# EasyEDA Pro project 三轮车驱动板.epro

# Schematic Schematic1

## Sheets
1 Power: Create Date: 2023-05-07; Page Name: Power; Project Name: 光设2023; Schematic Name: Schematic1; Update Date: 2023-05-07; Add into BOM: yes; Convert to PCB: yes
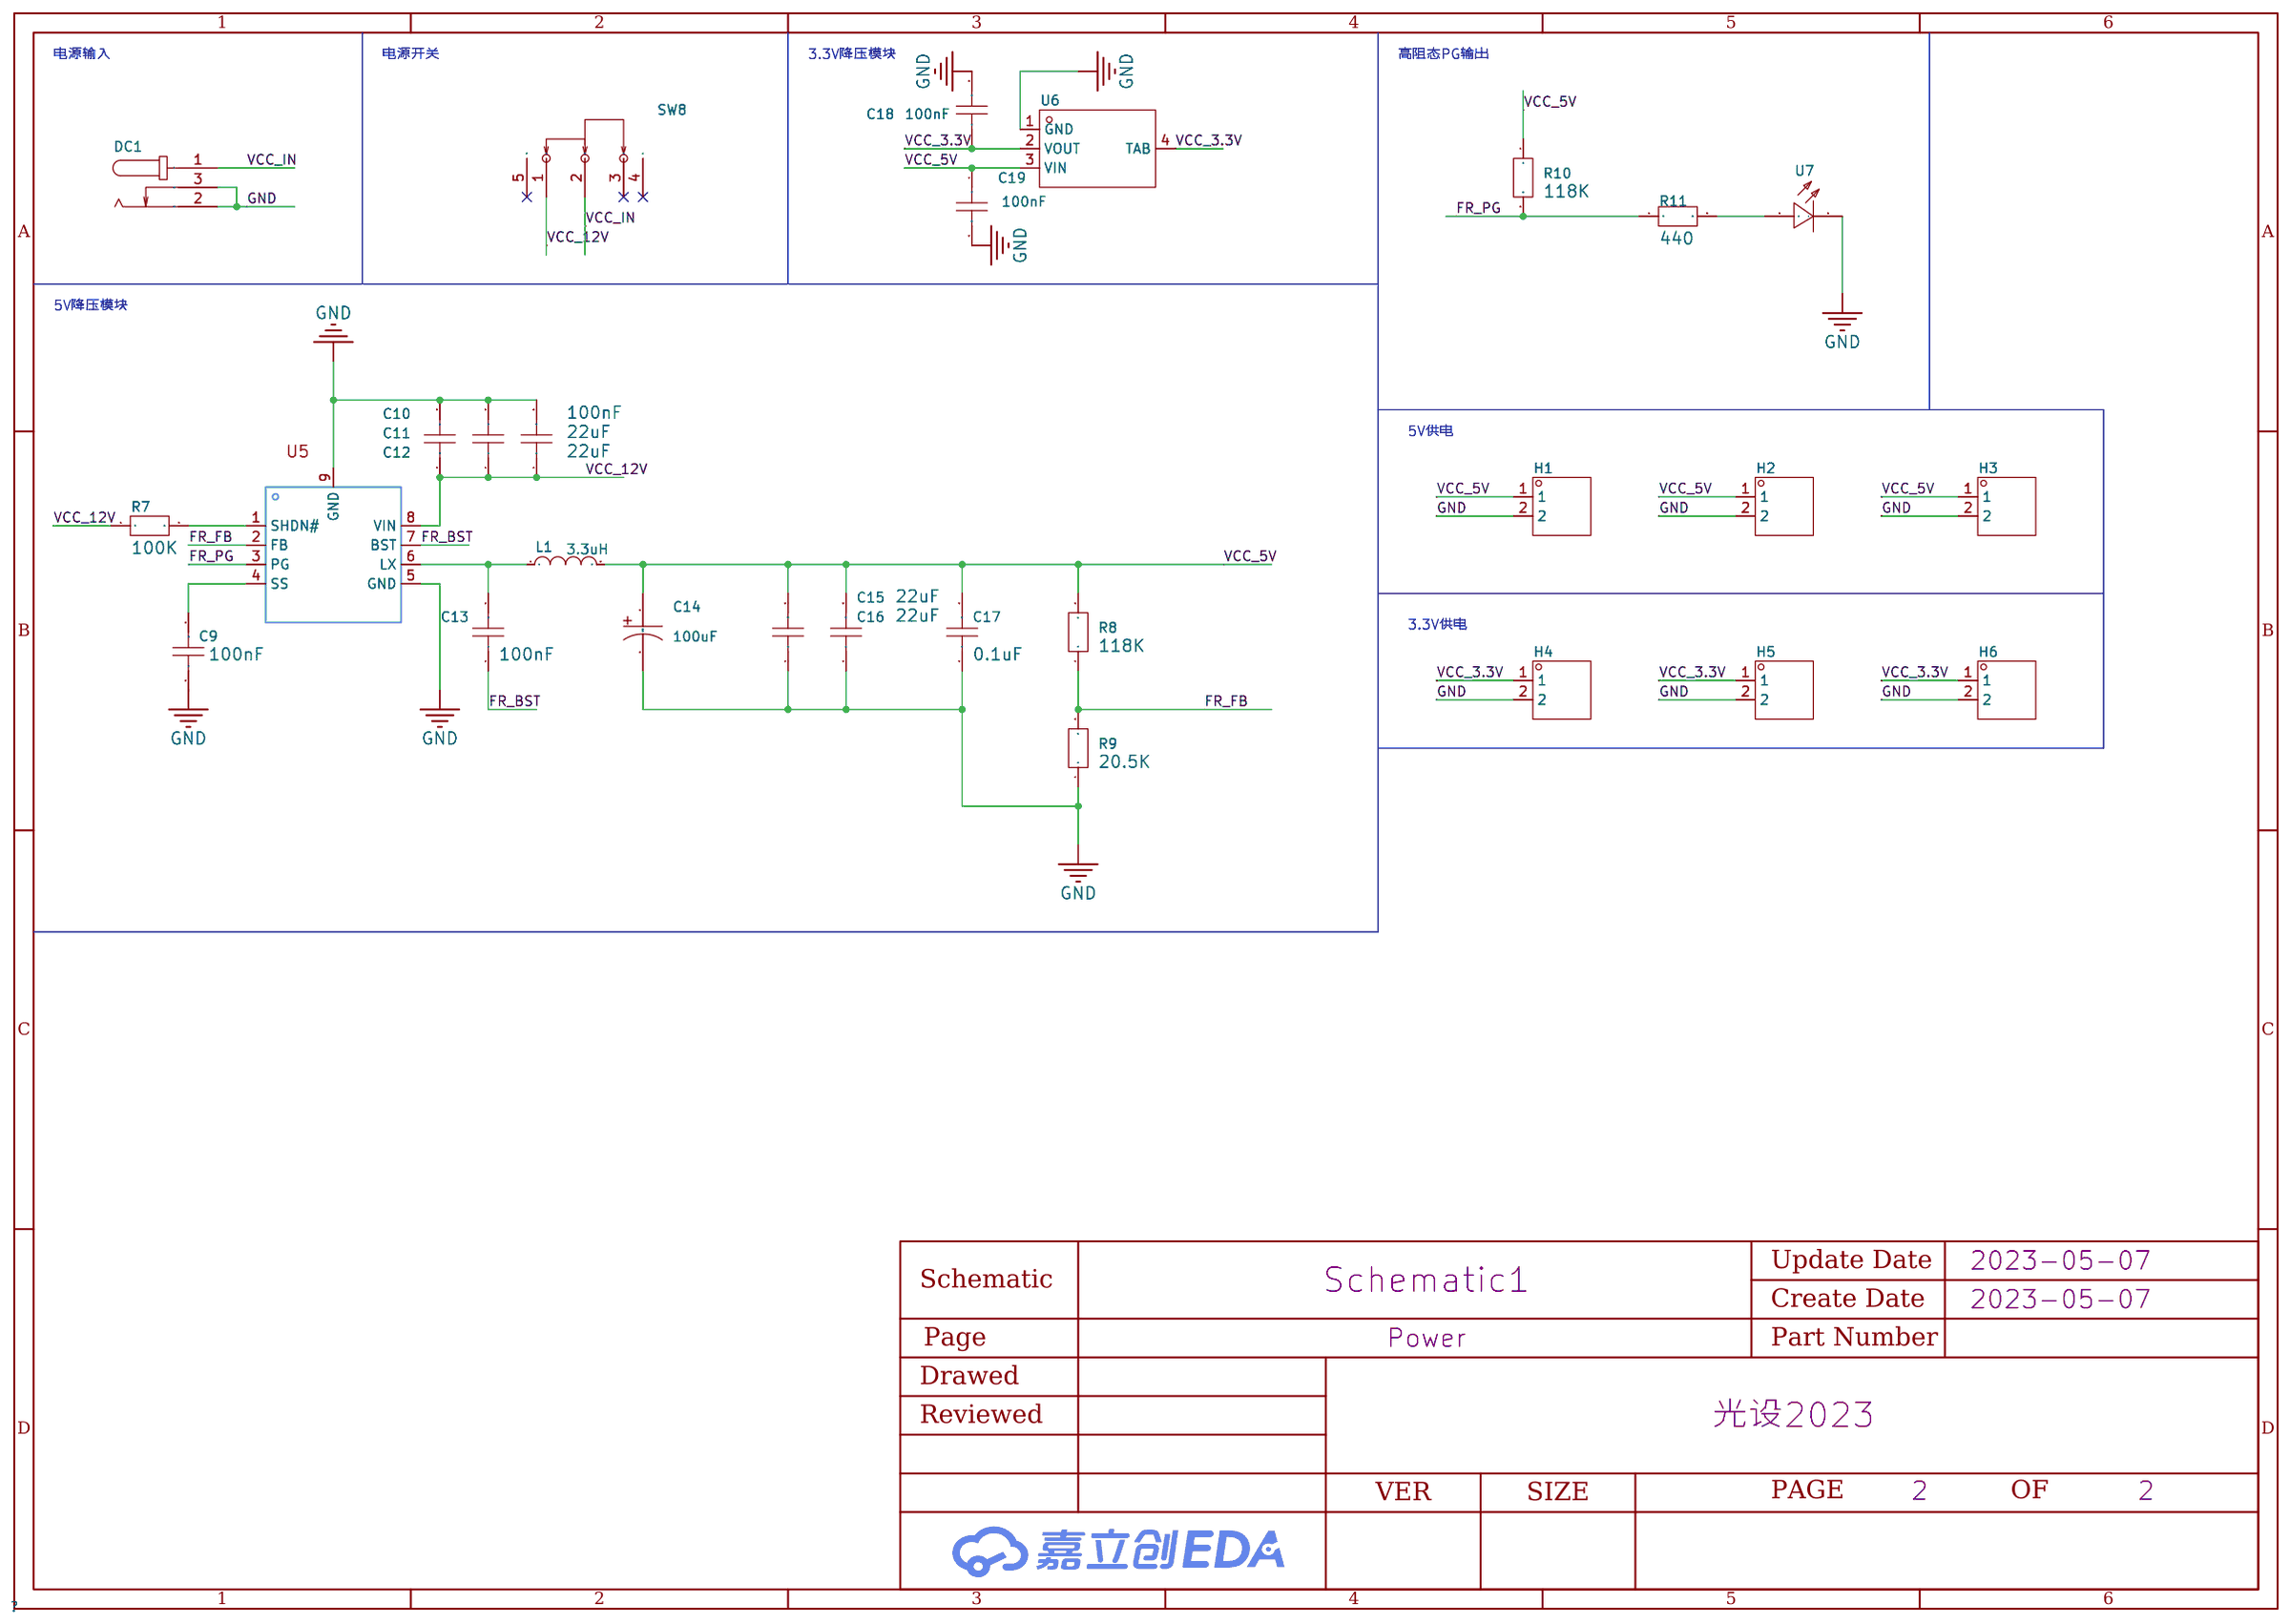
[diagram p0: Power]
2 C8T6: Create Date: 2023-05-08; Page Name: C8T6; Update Date: 2023-05-08; Company: 嘉立创EDA
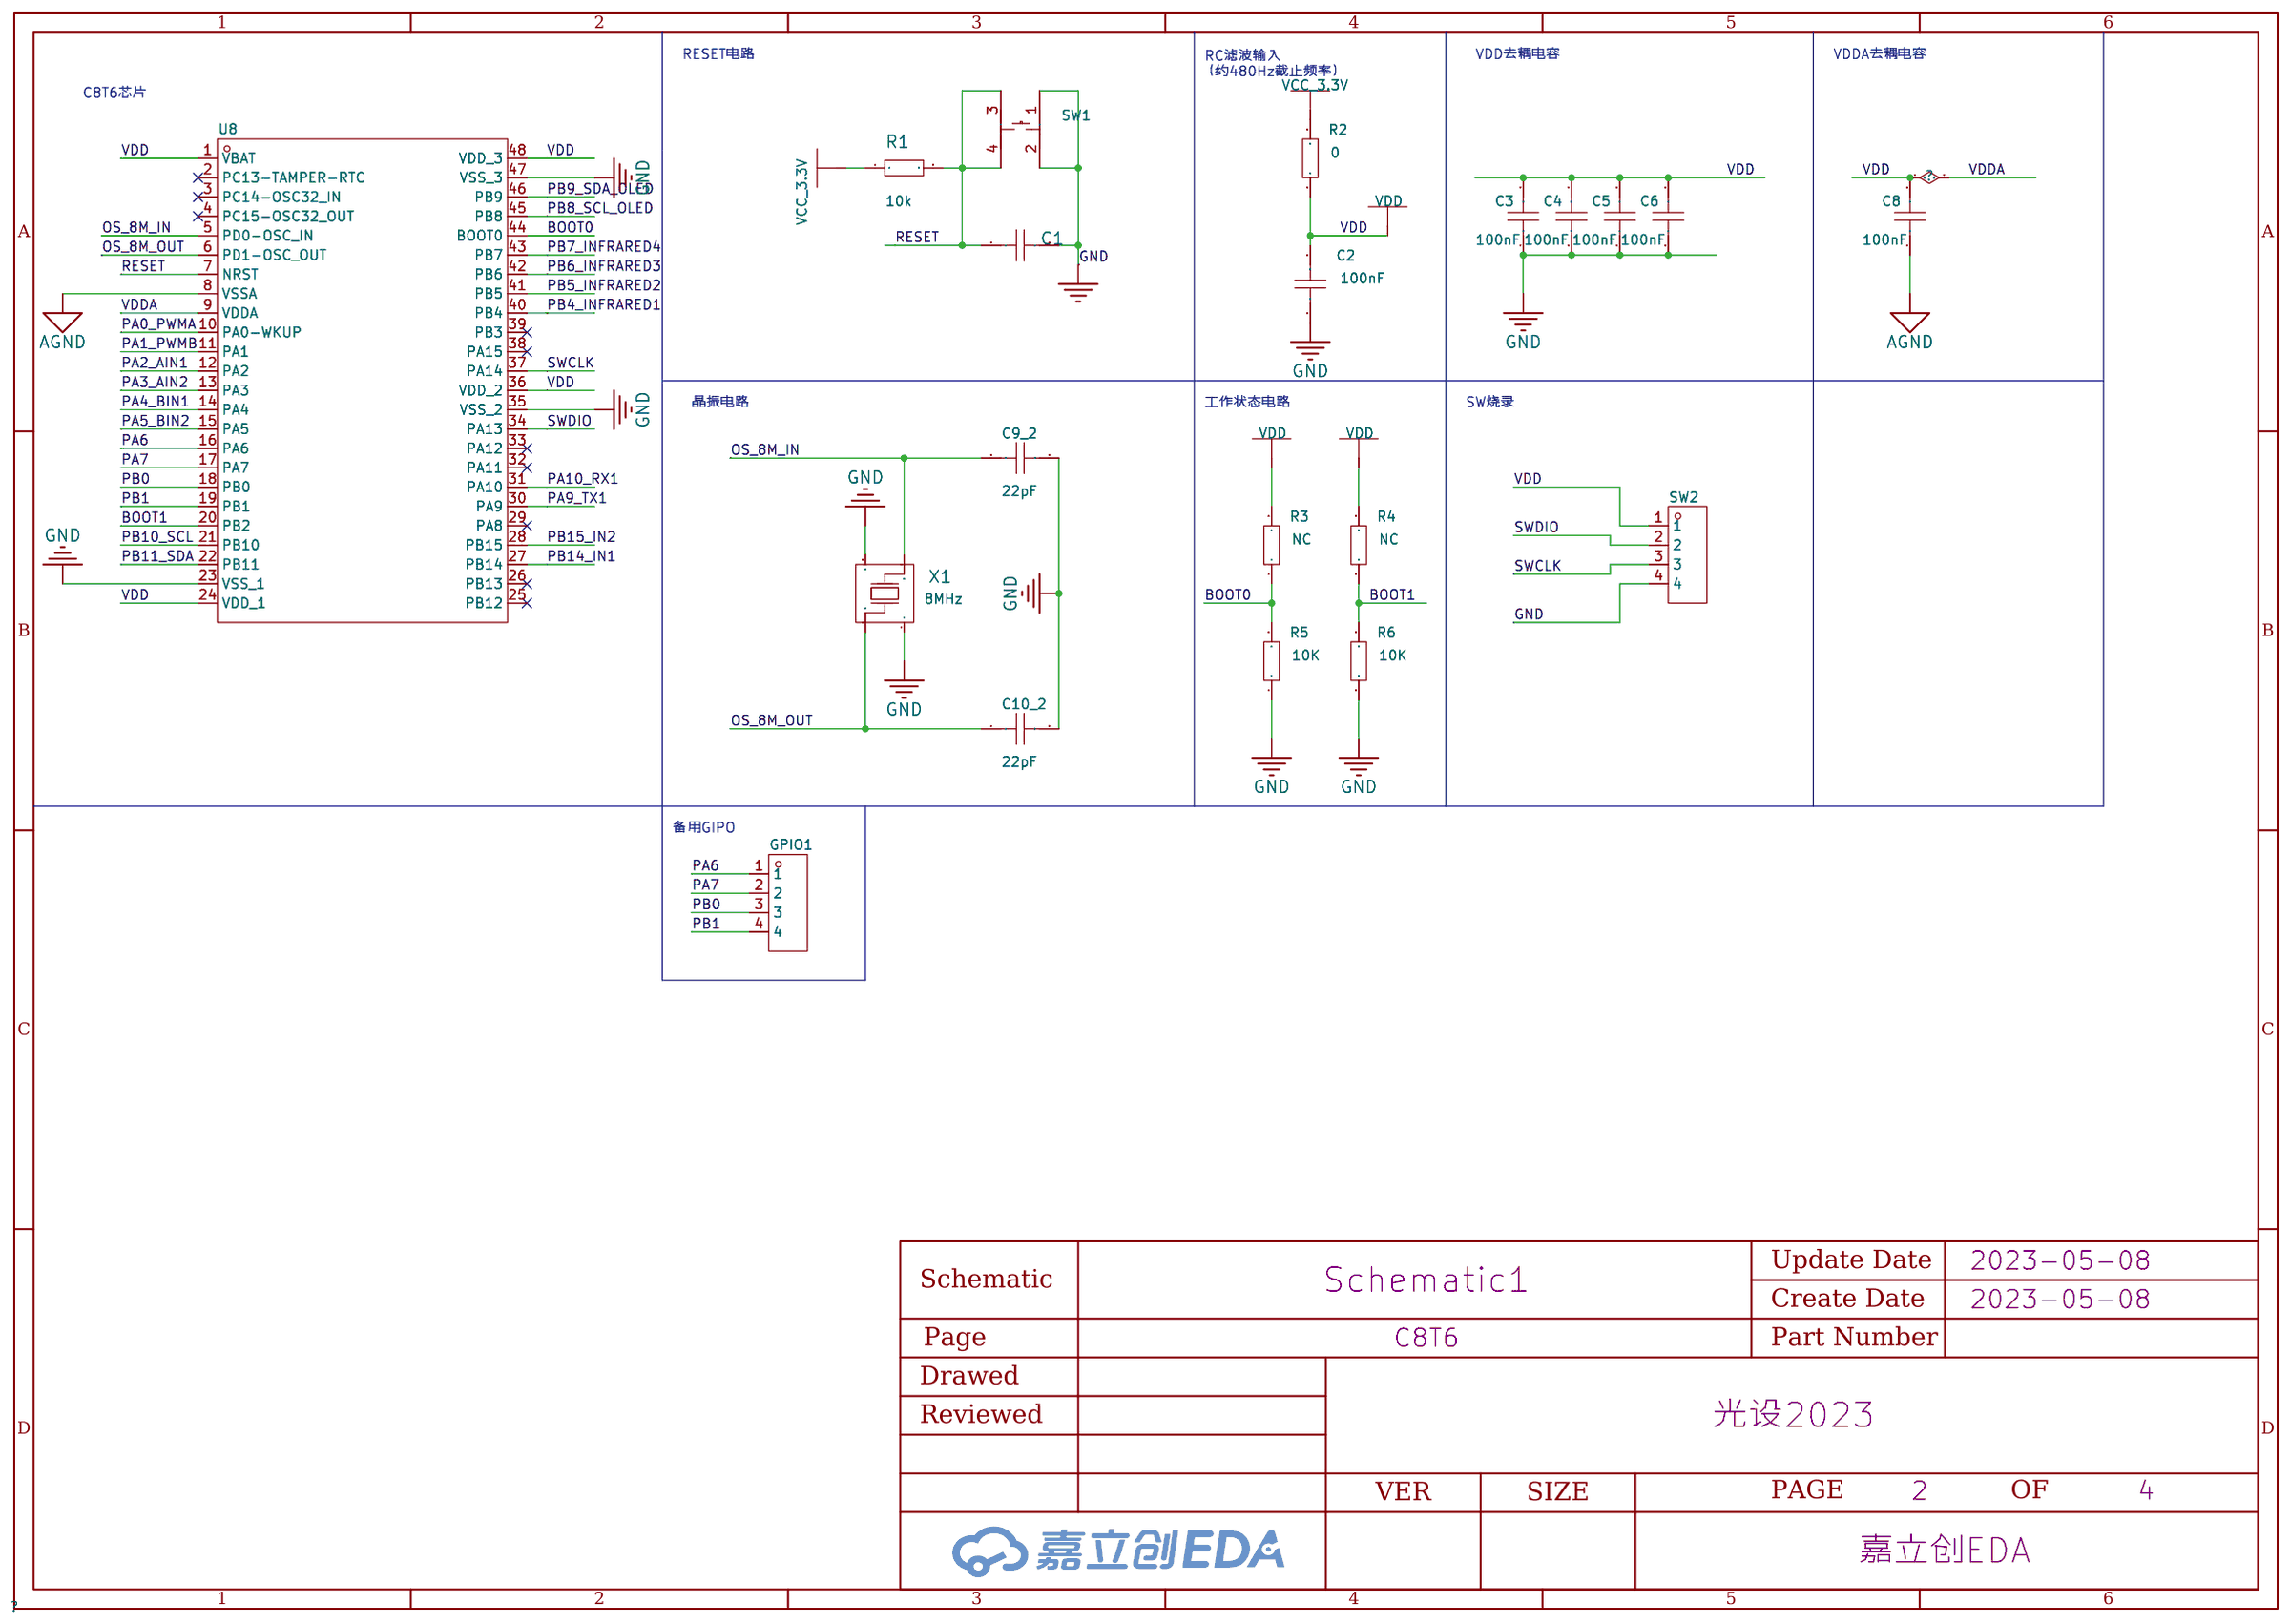
[diagram p1: C8T6]
3 raspberry: Create Date: 2023-05-08; Page Name: raspberry; Update Date: 2023-05-08; Company: 嘉立创EDA; Page Size: A4; Version: V1.0
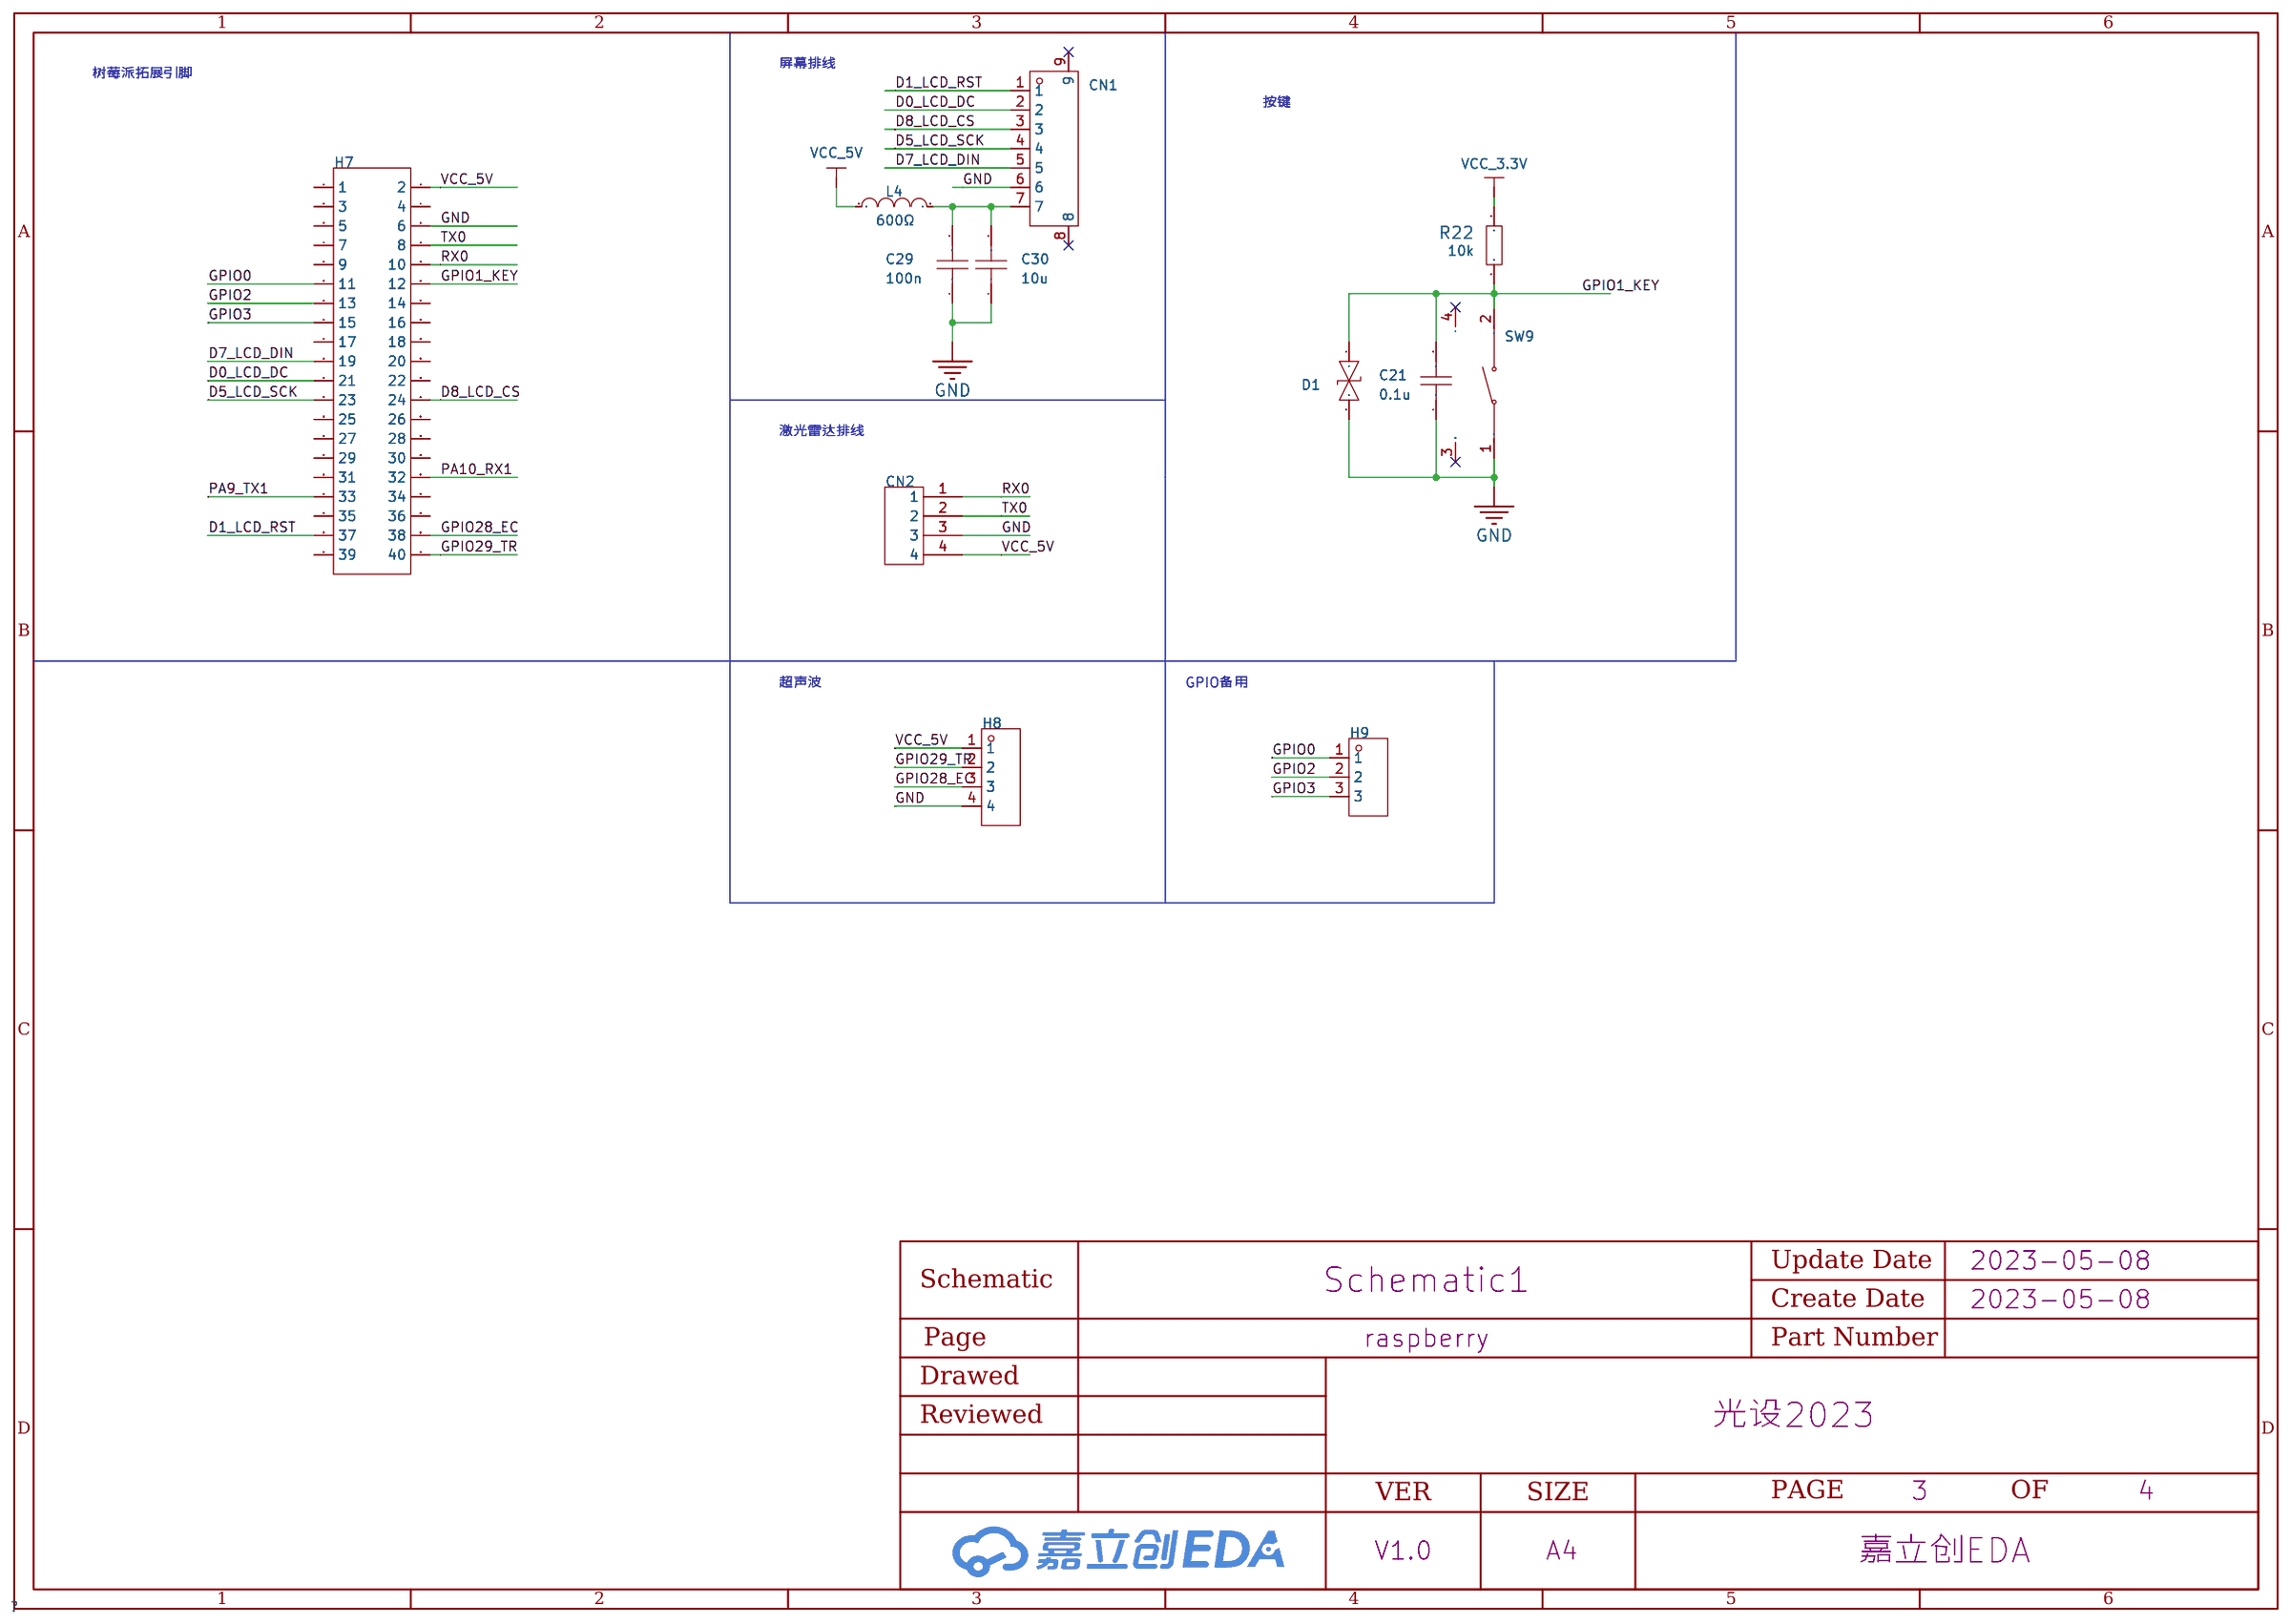
[diagram p2: raspberry]
4 harddrive: Create Date: 2023-05-08; Page Name: harddrive; Update Date: 2023-05-08; Company: 嘉立创EDA; Page Size: A4; Version: V1.0
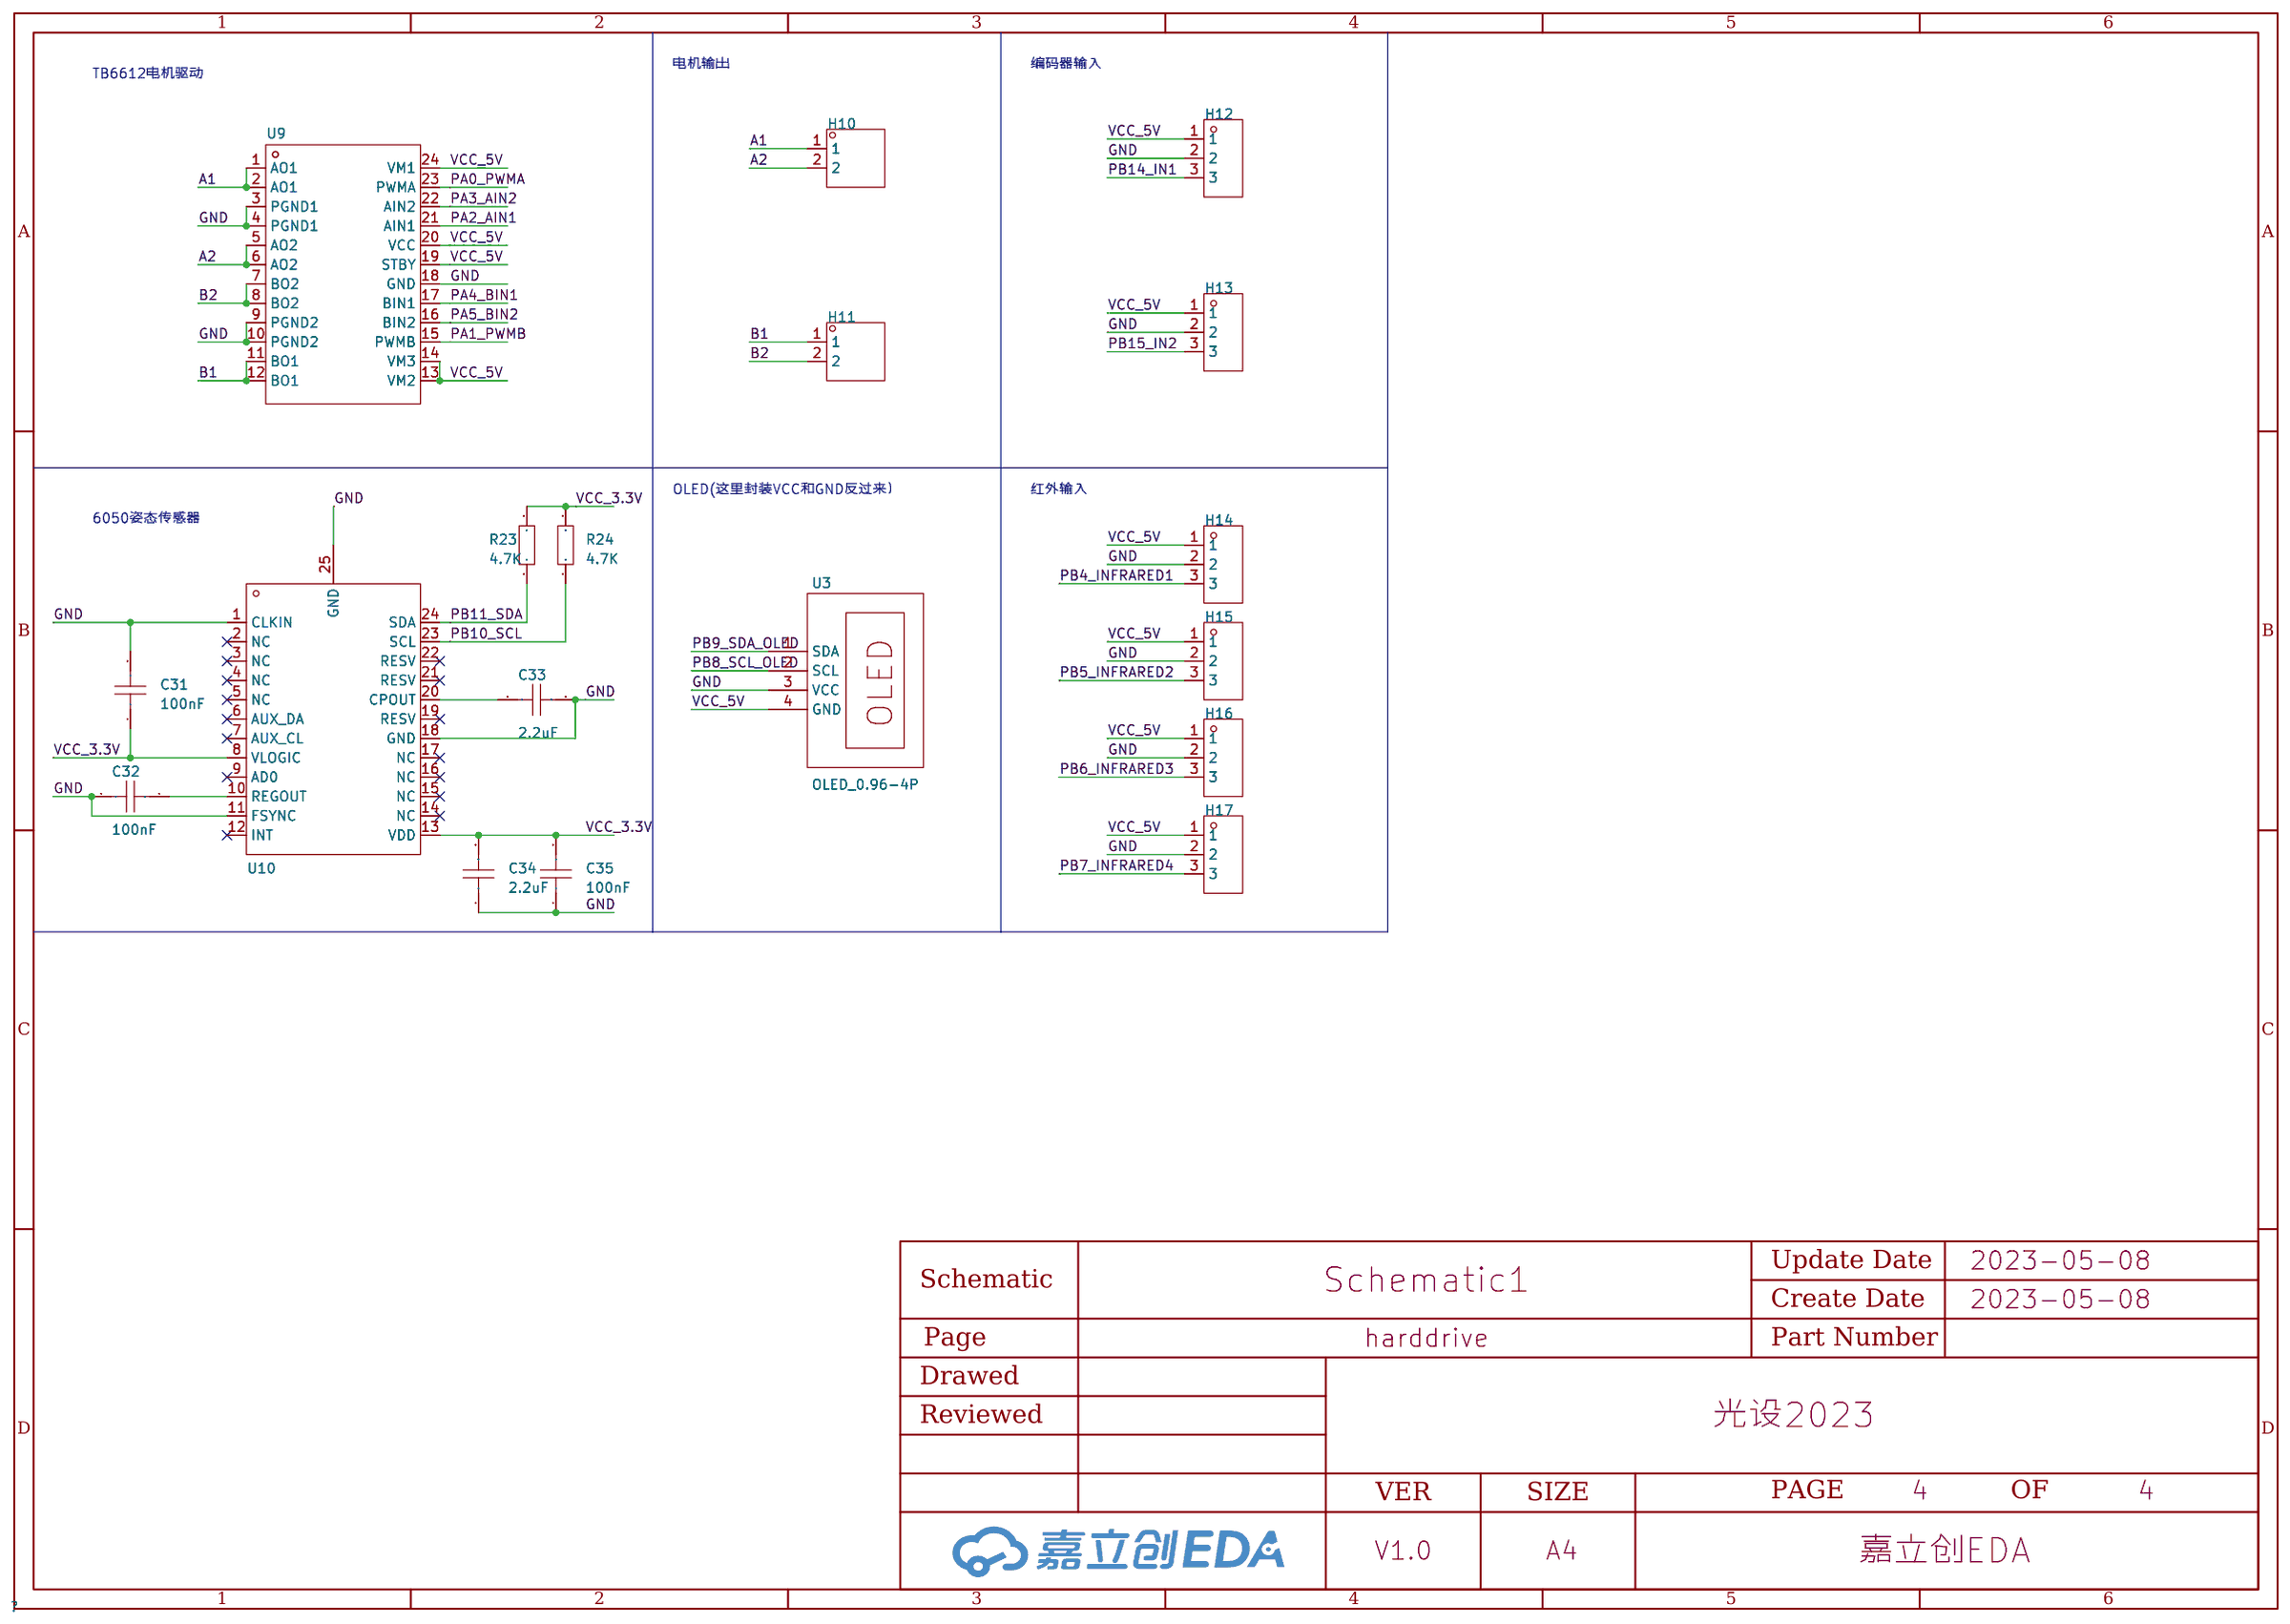
[diagram p3: harddrive]

## Parts
sheet C8T6
C1  0.1u  [C0603]
C2  100nF  [C0603]
C3  100nF  [C0603]
C4  100nF  [C0603]
C5  100nF  [C0603]
C6  100nF  [C0603]
C8  100nF  [C0603]
C9_2  22pF  [C0603]
C10_2  22pF  [C0603]
GPIO1  -  [HDR-TH_4P-P2.54-V-M]
R1  10k  [R0603]
R2  0  [R0603]
R3  NC  [R0603]
R4  NC  [R0603]
R5  10K  [R0603]
R6  10K  [R0603]
SW1  -  [SW-SMD_4P-L4.2-W3.4-P2.15-LS4.5-TL]
SW2  -  [HDR-TH_4P-P2.54-V-M]
U8  -  [LQFP-48_L7.0-W7.0-P0.50-LS9.0-BL]
X1  8MHz  [OSC-SMD_4P-L3.2-W2.5-BL]
sheet harddrive
C31  100nF  [C0603]
C32  100nF  [C0603]
C33  2.2uF  [C0603]
C34  2.2uF  [C0603]
C35  100nF  [C0603]
H10  -  [HDR-TH_2P-P2.54-V-M-1]
H11  -  [HDR-TH_2P-P2.54-V-M-1]
H12  -  [HDR-TH_3P-P2.54-V-M]
H13  -  [HDR-TH_3P-P2.54-V-M]
H14  -  [HDR-TH_3P-P2.54-V-M]
H15  -  [HDR-TH_3P-P2.54-V-M]
H16  -  [HDR-TH_3P-P2.54-V-M]
H17  -  [HDR-TH_3P-P2.54-V-M]
R23  4.7K  [R0603]
R24  4.7K  [R0603]
U3  OLED_0.96-4P  [OLED_0.96-4P]
U9  TB6612FNG,C,8,EL  [SSOP-24_L8.3-W5.6-P0.65-LS7.6-BL]
U10  MPU-6050  [QFN-24_L4.0-W4.0-P0.50-BL-EP2.7]
sheet Power
C9  100nF  [C0603]
C10  22uF  [C0603]
C11  22uF  [C0603]
C12  100nF  [C0603]
C13  100nF  [C0603]
C14  100uF  [CAP-SMD_BD6.3-L6.6-W6.6-LS7.6-FD]
C15  22uF  [C0603]
C16  22uF  [C0603]
C17  0.1uF  [C0603]
C18  100nF  [C1206]
C19  100nF  [C0603]
DC1  -  [DC-IN-TH_DC005]
H1  -  [HDR-TH_2P-P2.54-V-M-1]
H2  -  [HDR-TH_2P-P2.54-V-M-1]
H3  -  [HDR-TH_2P-P2.54-V-M-1]
H4  -  [HDR-TH_2P-P2.54-V-M-1]
H5  -  [HDR-TH_2P-P2.54-V-M-1]
H6  -  [HDR-TH_2P-P2.54-V-M-1]
L1  3.3uH  [IND-SMD_L7.0-W6.6]
R7  100K  [R0603]
R8  118K  [R0603]
R9  20.5K  [R0603]
R10  118K  [R0603]
R11  440  [R0603]
SW8  -  [SW-TH_SS-12F44-G5]
U5  FR9855SP  [SOIC-8_L4.9-W3.9-P1.27-LS6.0-BL-EP3.3]
U6  -  [SOT-223-3_L6.5-W3.4-P2.30-LS7.0-BR]
U7  -  [LED-TH_BD4.0-P2.54-FD_RED]
sheet raspberry
C21  0.1u  [C0603]
C29  100n  [C0603]
C30  10u  [C0603]
CN1  X8821WRS-07-9TSN  [CONN-SMD_X8821WRS-07-9TSN]
CN2  XH-4A  [CONN-TH_4P-P2.50_XH-4A]
D1  SD03C  [SOD-323_L1.8-W1.3-LS2.5-BI]
H7  2.54mm 2*20P直排针  [HDR-TH_40P-P2.54-V-M-R2-C20-S2.54]
H8  -  [HDR-TH_4P-P2.54-V-F]
H9  -  [HDR-TH_3P-P2.54-V-F]
L4  600Ω  [L0603]
R22  10k  [R0603]
SW9  KAN0637-0701B  [SW-TH_KAN0637-0701B]

## Library data of the parts
C1 = AC0603JRNPO9BN680: 容值:68pF;精度:±5%;额定电压:50V;温度系数:NP0;; LCSC Part Name: 68pF±5%50V; Supplier Part: C427063; Manufacturer: YAGEO(国巨); Supplier Footprint: 0603; JLCPCB Part Class: ExtendedPart; Datasheet: https://atta.szlcsc.com/upload/public/pdf/source/20190909/C427063_934C95D473187FC2F4988A8F2A9599CF.pdf; Supplier: LCSC; Tolerance: ±5%; Voltage Rated: 50V; Temperature Coefficient: NP0
C2-C6 C8 C9_2 C10_2 C19 = CAP_0603: 容值:100nF;精度:±10%;额定电压:50V;温度系数:X7R;; Supplier Footprint: 0603
GPIO1 SW2 = HDR-M_2.54_1x4P: Supplier Part: C492403; Supplier Footprint: 插件
R1 = AECR0603F1K50K9: 电阻类型:厚膜电阻;阻值:1.5kΩ;精度:±1%;功率:100mW;温度系数:±100ppm/℃;最大工作电压:50V;工作温度范围:-55℃~+125℃;; LCSC Part Name: 1.5kΩ±1%100mW; Supplier Part: C328342; Manufacturer: RESI(开步睿思）; Supplier Footprint: 0603; JLCPCB Part Class: ExtendedPart; Datasheet: https://atta.szlcsc.com/upload/public/pdf/source/20181108/C328342_08016E9BF35BA46A3CF0C17D76B66363.pdf; Supplier: LCSC; Type: 厚膜电阻; Tolerance: ±1%; Power(Watts): 100mW; Temperature Coefficient: ±100ppm/℃; Overload Voltage (Max): 50V; Operating Temperature Range: -55℃~+125℃
R2-R6 R23 R24 = Res_0603: Supplier Footprint: 0603
SW1 = YTSA016A0252501B: 触点电流:50mA;额定电压(DC):12V;绝缘电阻:100MΩ;电路结构:单刀单掷;安装方式:立贴;按钮形状:椭圆形按钮;按钮/盖帽颜色:白色;作用力:250gf;机械寿命:100000;引脚样式:J型引脚;开关长度:4.2mm;开关宽度:3.4mm;开关高度:2.5mm;带支架:否;; LCSC Part Name: 4.2*3.*2.5H-J250gf白钮翘脚编带; Supplier Part: C967791; Manufacturer: DGBZ(东莞博众); Supplier Footprint: SMD; JLCPCB Part Class: ExtendedPart; Datasheet: https://atta.szlcsc.com/upload/public/pdf/source/20201210/C967791_DCF099188004B981ADA3DDF2841F8914.pdf; Supplier: LCSC; Contact Current: 50mA; Voltage Rating (DC): 12V; Insulation Resistance: 100MΩ; Circuit: 单刀单掷; Mounting Style: 立贴; Actuator Style: 椭圆形按钮; Actuator/Cap Color: 白色; Operating Force: 250gf; Mechanical Life: 100000; Pin Style: J型引脚; Switch Length: 4.2mm; Switch Width: 3.4mm; Switch Height: 2.5mm; Strike Gundam: 否
U8 = STM32F103C8T6: CPU内核:ARM Cortex-M3;CPU最大主频:72MHz;工作电压范围:2V~3.6V;内部振荡器:有;程序 FLASH容量:64K@x8bit;RAM总容量:20KB;EEPROM/数据 FLASH容量:-;GPIO端口数量:37;ADC(单元数/通道数/位数):1@x10ch/12bit;外设/功能/协议栈:温度传感器；DMA；看门狗；POR；PWM;工作温度范围:-40~+85;; LCSC Part Name: STM32F103C8T6MSL=3; Supplier Part: C8734; Manufacturer: ST(意法半导体); Supplier Footprint: LQFP-48_7x7x05P; JLCPCB Part Class: 基础库; Datasheet: https://atta.szlcsc.com/upload/public/pdf/source/20140724/1457707174202.pdf; Supplier: LCSC; CPU Core: ARMCortex-M3; Maximum Frequency: 72MHz; Supply Voltage Range: 2V~3.6V; Internal Oscillator: 有; Program FLASH Size: 64K@x8bit; RAM Size: 20KB; GPIO Ports Number: 37; ADC (Units/Channels/bits): 1@x10ch/12bit; Peripherals / Functions / Protocol Stacks: 温度传感器；DMA；看门狗；POR；PWM; Operating Temperature Range: -40~+85
X1 = TAXM8M4RDBCCT2T: 晶振类型:-;频率:-;频率公差:-;频率稳定度:-;负载电容:-;工作温度:-;; LCSC Part Name: 8MHz10pF±10ppm; Supplier Part: C400090; Manufacturer: TAE(雅晶鑫); Supplier Footprint: SMD3225-4P; JLCPCB Part Class: ExtendedPart; Datasheet: https://atta.szlcsc.com/upload/public/pdf/source/20190626/C400090_CF95B89E745AFE4EF2E392EF8AC009D6.pdf; Supplier: LCSC
C21 C29-C35 = CAP_0603: Supplier Footprint: 0603
H1-H6 H10 H11 = HDR-M_2.54_1x2P: Supplier Part: C124375; Supplier Footprint: 插件
H12-H17 = HDR-M_2.54_1x3P: Supplier Part: C2937625; Supplier Footprint: 插件
U3 = oled_0.96-4p
U9 = TB6612FNG,C,8,EL: 类型:有刷直流电机;电源电压:2.7V~5.5V;输出电流:1A;接口:并行;; Supplier Part: C141517; Manufacturer: TOSHIBA(东芝); Supplier Footprint: SSOP-24; JLCPCB Part Class: Extended Part; Datasheet: https://atta.szlcsc.com/upload/public/pdf/source/20171128/C141517_15118625624231147036.pdf; Supplier: LCSC; Type: 有刷直流电机; Supply Voltage: 2.7V~5.5V; Output Current: 1A; Interface: 并行; Operating Temperature: -20℃~+85℃@(Ta)
U10 = MPU-6050: 三轴加速度计和三轴陀螺仪，工作电压：2.375V~3.46V; Supplier Part: C24112; Manufacturer: TDK InvenSense(应美盛); Supplier Footprint: QFN-24(4x4); JLCPCB Part Class: Basic Part; Datasheet: https://atta.szlcsc.com/upload/public/pdf/source/20140425/1457707046159.pdf; Supplier: LCSC
C9-C13 C15-C17 = 0603: Supplier Part: C9900021180; JLCPCB Part Class: ExtendedPart; Datasheet: https://atta.szlcsc.comnull; Supplier: LCSC
C14 = 35TZV100MSPA6.3X8: 容值:100uF;精度:±20%;额定电压:35V;电容体直径:6.3mm;电容体长度:8mm;纹波电流:-;等效串联电阻:-;工作寿命:2000hrs@105;工作温度:-45~+105;; LCSC Part Name: 100uF±20%35V; Supplier Part: C239317; Manufacturer: rubycon(红宝石); Supplier Footprint: SMD,6.3x8mm; JLCPCB Part Class: ExtendedPart; Datasheet: https://atta.szlcsc.com/upload/public/pdf/source/20180704/C239317_CF7C0F1687B1C8C4BE5EA2FCFFE2F109.pdf; Supplier: LCSC; Tolerance: ±20%; Rated Voltage: 35V; φD: 6.3mm; L: 8mm; Lifetime @ Temp: 2000hrs@105; Operating Temperature: -45~+105
C18 = CAP_1206: 容值:100nF;精度:±10%;额定电压:50V;温度系数:X7R;; Supplier Footprint: 1206
DC1 = DC005: 连接器类型:DC电源插座;安装方式:弯插;触点内径:2mm;触点外径:6.3mm;额定电流:500mA;额定电压:30V;工作温度范围:-40~+55;; LCSC Part Name: DC电源插座内径:2mm外径:6.3mm铁材质; Supplier Part: C431533; Manufacturer: SHOUHAN(首韩); Supplier Footprint: 插件; JLCPCB Part Class: ExtendedPart; Datasheet: https://atta.szlcsc.com/upload/public/pdf/source/20190925/C431533_4751811035784AC1D38EBC85F7905E99.pdf; Supplier: LCSC; Connector Type: DC电源插座; Mounting Style: 弯插; Inside Contact Diameter: 2mm; Outside Contact Diameter: 6.3mm; Current Rating (Max): 500mA; Voltage Rating (Max): 30V; Operating Temperature Range: -40~+55
L1 = MDE0630-3R3M: 电感值:3.3uH;精度:±20%;额定电流:8.5A;直流电阻(DCR):22mΩ;; LCSC Part Name: 3.3uH±20%8.5A22mΩ; Supplier Part: C842910; Manufacturer: KOHERelec(科或); Supplier Footprint: SMD; JLCPCB Part Class: ExtendedPart; Datasheet: https://atta.szlcsc.com/upload/public/pdf/source/20201020/C842876_921BC143FC4038D46DEA50C28FA6C954.pdf; Supplier: LCSC; Tolerance: ±20%; Rated Current: 8.5A; DC Resistance (DCR): 22mΩ
R7-R11 = 0603: Supplier Part: C9900021178; JLCPCB Part Class: ExtendedPart; Datasheet: https://atta.szlcsc.comnull; Supplier: LCSC
SW8 = SS-12F44-G5: LCSC Part Name: 拨动开关12.1*5.6*13.9; Supplier Part: C620367; Manufacturer: USAKRO(美韩); Supplier Footprint: 插件,12.1x5.6x13.9mm; JLCPCB Part Class: ExtendedPart; Datasheet: https://atta.szlcsc.com/upload/public/pdf/source/20200616/C620367_5E5EC4F271CAA6AC20E19D2721D15308.pdf; Supplier: LCSC
U5 = FR9855SP: Supplier: LCSC; Supplier Part: C389169; Manufacturer: FitipowerIntegratedTech; JLCPCB Part Class: ExtendedPart
U6 = AMS1117-3.3: 输出类型:固定;输出极性:正;输出通道数:1;最大输入电压:18V;输出电压:3.3V;压差:1.4V@(1A);输出电流:800mA;电源纹波抑制比(PRSS):-;; LCSC Part Name: Vin=18VVout=3.3V800mA; Supplier Part: C351784; Manufacturer: PUOLOP(迪浦); Supplier Footprint: SOT-223; JLCPCB Part Class: ExtendedPart; Datasheet: https://atta.szlcsc.com/upload/public/pdf/source/20210915/EA806799CEEC3F52E0A4FA8303A508AC.pdf; Supplier: LCSC; Output Type: 固定; Output Polarity: 正; Number of Outputs: 1; Maximum Input Voltage: 18V; Output Voltage: 3.3V; Dropout Voltage: 1.4V@(1A); Output Current: 800mA
U7 = LED: Supplier Part: C9900015665; Supplier Footprint: SIP-2P; JLCPCB Part Class: ExtendedPart; Datasheet: https://atta.szlcsc.comnull; Supplier: LCSC
CN1 = X8821WRS-07-9TSN: 参考系列:-;间距:2.5mm;插针结构:1x7P;排数:1;每排PIN数:7;行距:-;公母:公型插针;安装方式:卧贴;额定电流:3A;触头材质:黄铜;触头镀层:锡;工作温度范围:-25℃~+85℃;焊接温度(最大值):260℃;; LCSC Part Name: 2.5mm 1x7P 卧贴; Supplier Part: C519020; Manufacturer: XKB Connectivity(中国星坤); Supplier Footprint: SMD,P=2.5mm; JLCPCB Part Class: Extended Part; Datasheet: https://atta.szlcsc.com/upload/public/pdf/source/20211009/147B79B22FE81B32D021ABC3AE751292.pdf; Supplier: LCSC; Pitch: 2.5mm; Pins Structure: 1x7P; Number of Rows: 1; Number of PINs Per Row: 7; Gender: 公型插针; Mounting Style: 卧贴; Current Rating (Max): 3A; Contact Material: 黄铜; Contact Plating: 锡; Operating Temperature Range: -25℃~+85℃; Welding Temperature (Max): 260℃
CN2 = XH-4A_C37815: 参考系列:XH;间距:2.5mm;插针结构:1x4P;排数:1;每排PIN数:4;行距:-;安装方式:-;触头材质:磷青铜;; LCSC Part Name: XH 2.5mm 1x4P; Supplier Part: C37815; Manufacturer: BOOMELE(博穆精密); Supplier Footprint: 插件,P=2.5mm; JLCPCB Part Class: Extended Part; Datasheet: https://atta.szlcsc.com/upload/public/pdf/source/20170919/C37815_1505787307039977083.pdf; Supplier: LCSC; Reference Series: XH; Pitch: 2.5mm; Pins Structure: 1x4P; Number of Rows: 1; Number of PINs Per Row: 4; Contact Material: 磷青铜
D1 = SD03C_C502532: 极性:双向;反向截止电压(Vrwm):3.3V;击穿电压(最小值):4V;峰值脉冲电流(Ipp)@10/1000μs:20A;最大钳位电压:16V;; LCSC Part Name: 双向 3.3V; Supplier Part: C502532; Manufacturer: MDD; Supplier Footprint: SOD-323; JLCPCB Part Class: Extended Part; Datasheet: https://atta.szlcsc.com/upload/public/pdf/source/20200324/C502532_7D4F0BBE100E5AA5810517A79C4A6636.pdf; Supplier: LCSC; Polarity: 双向; Reverse Stand-Off Voltage (Vrwm): 3.3V; Breakdown Voltage (Min): 4V; Peak Pulse Current (Ipp)@10/1000μs: 20A; Maximum Clamping Voltage: 16V
H7 = 2.54mm 2*20P直排针: 排数:双排;总PIN位数:40;间距:2.54mm;插针结构:2x20P;行距:2.54mm;安装类型:直插;圆针/方针:方针;额定电流:3A;额定电压:-;配合针长度:6mm;塑高:-;端接针长度:3mm;触头材质:黄铜;触头镀层:-;工作温度范围:-40℃~+105℃;颜色:黑色;; LCSC Part Name: 2.54mm 2x20P 直插 方针; Supplier Part: C50980; Manufacturer: BOOMELE(博穆精密); Supplier Footprint: 直插,P=2.54mm; JLCPCB Part Class: Extended Part; Datasheet: https://atta.szlcsc.com/upload/public/pdf/source/20151109/1457707571465.pdf; Supplier: LCSC; Number of Rows: 双排; Number of Pins: 40; Pitch: 2.54mm; Pin Structure: 2x20P; Row Spacing: 2.54mm; Mounting Type: 直插; Circluar Pins/Square Pins: 方针; Current Rating (Max): 3A; Length of Mating Pin: 6mm; Length of End Connection Pin: 3mm; Contact Material: 黄铜; Operating Temperature Range: -40℃~+105℃; Color: 黑色
H8 = HDR-F_2.54_1x4P: Supplier Part: C2718488; Supplier Footprint: 插件
H9 = HDR-F_2.54_1x3P: Supplier Part: C541850; Supplier Footprint: 插件
L4 = L_0603
R22 = AECR0603F1K50K9: 电阻类型:厚膜电阻;阻值:1.5kΩ;精度:±1%;功率:100mW;温度系数:±100ppm/℃;最大工作电压:50V;工作温度范围:-55℃~+125℃;; LCSC Part Name: 1.5kΩ ±1% 100mW; Supplier Part: C328342; Manufacturer: RESI(开步睿思）; Supplier Footprint: 0603; JLCPCB Part Class: Extended Part; Datasheet: https://atta.szlcsc.com/upload/public/pdf/source/20181108/C328342_08016E9BF35BA46A3CF0C17D76B66363.pdf; Supplier: LCSC; Type: 厚膜电阻; Tolerance: ±1%; Power(Watts): 100mW; Temperature Coefficient: ±100ppm/℃; Overload Voltage (Max): 50V; Operating Temperature Range: -55℃~+125℃
SW9 = KAN0637-0701B: 触点电流:50mA;额定电压(DC):12V;电路结构:单刀单掷;按钮作用方向:侧面触动;致动器样式:圆形按钮;照明颜色:-;; LCSC Part Name: KAN0637-0701B,带支架侧插; Supplier Part: C231668; Manufacturer: GANGYUAN(港源); Supplier Footprint: 插件; JLCPCB Part Class: Extended Part; Datasheet: https://atta.szlcsc.com/upload/public/pdf/source/20190514/C231668_6047F7280E58C7CF3EE5207263CCBB46.pdf; Supplier: LCSC; Contact Current: 50mA; Voltage Rating (DC): 12V; Circuit: 单刀单掷; Actuator Orientation: 侧面触动; Actuator Style: 圆形按钮

## Nets
AGND: C8.1 U8.8(VSSA)
GND: C1.2 C2.1 C3.1 C4.1 C5.1 C6.1 C9.1 C9_2.2 C10.2 C10_2.2 C11.2 C12.2 C14.2 C15.1 C16.1 C17.1 C18.2 C19.2 C21.1 C29.1 C30.1 C31.2 C32.2 C33.2 C34.1 C35.1 CN1.6 CN2.3 D1.2 DC1.2 DC1.3 H1.2 H2.2 H3.2 H4.2 H5.2 H6.2 H7.6 H8.4 H12.2 H13.2 H14.2 H15.2 H16.2 H17.2 R5.1 R6.1 R9.1 SW1.1 SW1.2 SW2.4 SW9.1 U3.3(VCC) U5.5(GND) U5.9(GND) U6.1(GND) U7.2(-) U8.23(VSS_1) U8.35(VSS_2) U8.47(VSS_3) U9.3(PGND1) U9.4(PGND1) U9.9(PGND2) U9.10(PGND2) U9.18(GND) U10.1(CLKIN) U10.11(FSYNC) U10.18(GND) U10.25(GND) X1.2 X1.4
VCC_3.3V: C18.1 C31.1 C34.2 C35.2 H4.1 H5.1 H6.1 R1.1 R2.2 R22.2 R23.2 R24.2 U6.2(VOUT) U6.4(TAB) U10.8(VLOGIC) U10.13(VDD)
VCC_5V: C14.1 C15.2 C16.2 C17.2 C19.1 CN2.4 H1.1 H2.1 H3.1 H7.2 H8.1 H12.1 H13.1 H14.1 H15.1 H16.1 H17.1 L1.2 L4.1 R8.2 R10.1 U3.4(GND) U6.3(VIN) U9.13(VM2) U9.14(VM3) U9.19(STBY) U9.20(VCC) U9.24(VM1)
VCC_12V: C10.1 C11.1 C12.1 R7.1 SW8.1 U5.8(VIN)
VCC_IN: DC1.1 SW8.2
VDD: C2.2 C3.2 C4.2 C5.2 C6.2 C8.2 R2.1 R3.2 R4.2 SW2.1 U8.1(VBAT) U8.9(VDDA) U8.24(VDD_1) U8.36(VDD_2) U8.48(VDD_3)
A1: H10.1 U9.1(AO1) U9.2(AO1)
A2: H10.2 U9.5(AO2) U9.6(AO2)
B1: H11.1 U9.11(BO1) U9.12(BO1)
B2: H11.2 U9.7(BO2) U9.8(BO2)
BOOT0: R3.1 R5.2 U8.44(BOOT0)
BOOT1: R4.1 R6.2 U8.20(PB2)
D0_LCD_DC: CN1.2 H7.21
D1_LCD_RST: CN1.1 H7.37
D5_LCD_SCK: CN1.4 H7.23
D7_LCD_DIN: CN1.5 H7.19
D8_LCD_CS: CN1.3 H7.24
FR_BST: C13.1 U5.7(BST)
FR_FB: R8.1 R9.2 U5.2(FB)
FR_PG: R10.2 R11.1 U5.3(PG)
GPIO0: H7.11 H9.1
GPIO1_KEY: C21.2 D1.1 H7.12 R22.1 SW9.2
GPIO2: H7.13 H9.2
GPIO3: H7.15 H9.3
GPIO28_EC: H7.38 H8.3
GPIO29_TR: H7.40 H8.2
OS_8M_IN: C9_2.1 U8.5(PD0-OSC_IN) X1.3
OS_8M_OUT: C10_2.1 U8.6(PD1-OSC_OUT) X1.1
PA0_PWMA: U8.10(PA0-WKUP) U9.23(PWMA)
PA1_PWMB: U8.11(PA1) U9.15(PWMB)
PA2_AIN1: U8.12(PA2) U9.21(AIN1)
PA3_AIN2: U8.13(PA3) U9.22(AIN2)
PA4_BIN1: U8.14(PA4) U9.17(BIN1)
PA5_BIN2: U8.15(PA5) U9.16(BIN2)
PA6: GPIO1.1 U8.16(PA6)
PA7: GPIO1.2 U8.17(PA7)
PA9_TX1: H7.33 U8.30(PA9)
PA10_RX1: H7.32 U8.31(PA10)
PB0: GPIO1.3 U8.18(PB0)
PB1: GPIO1.4 U8.19(PB1)
PB4_INFRARED1: H14.3 U8.40(PB4)
PB5_INFRARED2: H15.3 U8.41(PB5)
PB6_INFRARED3: H16.3 U8.42(PB6)
PB7_INFRARED4: H17.3 U8.43(PB7)
PB8_SCL_OLED: U3.2(SCL) U8.45(PB8)
PB9_SDA_OLED: U3.1(SDA) U8.46(PB9)
PB10_SCL: R24.1 U8.21(PB10) U10.23(SCL)
PB11_SDA: R23.1 U8.22(PB11) U10.24(SDA)
PB14_IN1: H12.3 U8.27(PB14)
PB15_IN2: H13.3 U8.28(PB15)
RESET: C1.1 R1.2 SW1.3 SW1.4 U8.7(NRST)
RX0: CN2.1 H7.10
SWCLK: SW2.3 U8.37(PA14)
SWDIO: SW2.2 U8.34(PA13)
TX0: CN2.2 H7.8
$4N1181: R7.2 U5.1(SHDN#)
$4N1291: C9.2 U5.4(SS)
$4N2089: C13.2 L1.1 U5.6(LX)
$4N5315: R11.2 U7.1(+)
$6N577: C29.2 C30.2 CN1.7 L4.2
$7N1404: C32.1 U10.10(REGOUT)
$7N1517: C33.1 U10.20(CPOUT)

Not connected (* = marked no-connect by the designer): CN1 8* 9*; H7 1 3 4 5 7 9 14 16 17 18 20 22 25 26 27 28 29 30 31 34 35 36 39; SW8 3* 4* 5*; SW9 3* 4*; U8 2(PC13-TAMPER-RTC)* 3(PC14-OSC32_IN)* 4(PC15-OSC32_OUT)* 25(PB12)* 26(PB13)* 29(PA8)* 32(PA11)* 33(PA12)* 38(PA15)* 39(PB3)*; U10 2(NC)* 3(NC)* 4(NC)* 5(NC)* 6(AUX_DA)* 7(AUX_CL)* 9(AD0)* 12(INT)* 14(NC)* 15(NC)* 16(NC)* 17(NC)* 19(RESV)* 21(RESV)* 22(RESV)*

## Notes on the sheets
sheet 1
- 电源输入
- 电源开关
- 3.3V降压模块
- 高阻态PG输出
- 5V降压模块
- 5V供电
- 3.3V供电
sheet 2
- RESET电路
- RC滤波输入
  （约480Hz截止频率）
- VDD去耦电容
- VDDA去耦电容
- C8T6芯片
- 晶振电路
- 工作状态电路
- SW烧录
- 备用GIPO
sheet 3
- 树莓派拓展引脚
- 屏幕排线
- 按键
- 激光雷达排线
- 超声波
- GPIO备用
sheet 4
- TB6612电机驱动
- 电机输出
- 编码器输入
- OLED(这里封装VCC和GND反过来）
- 红外输入
- 6050姿态传感器

# Board PCB1
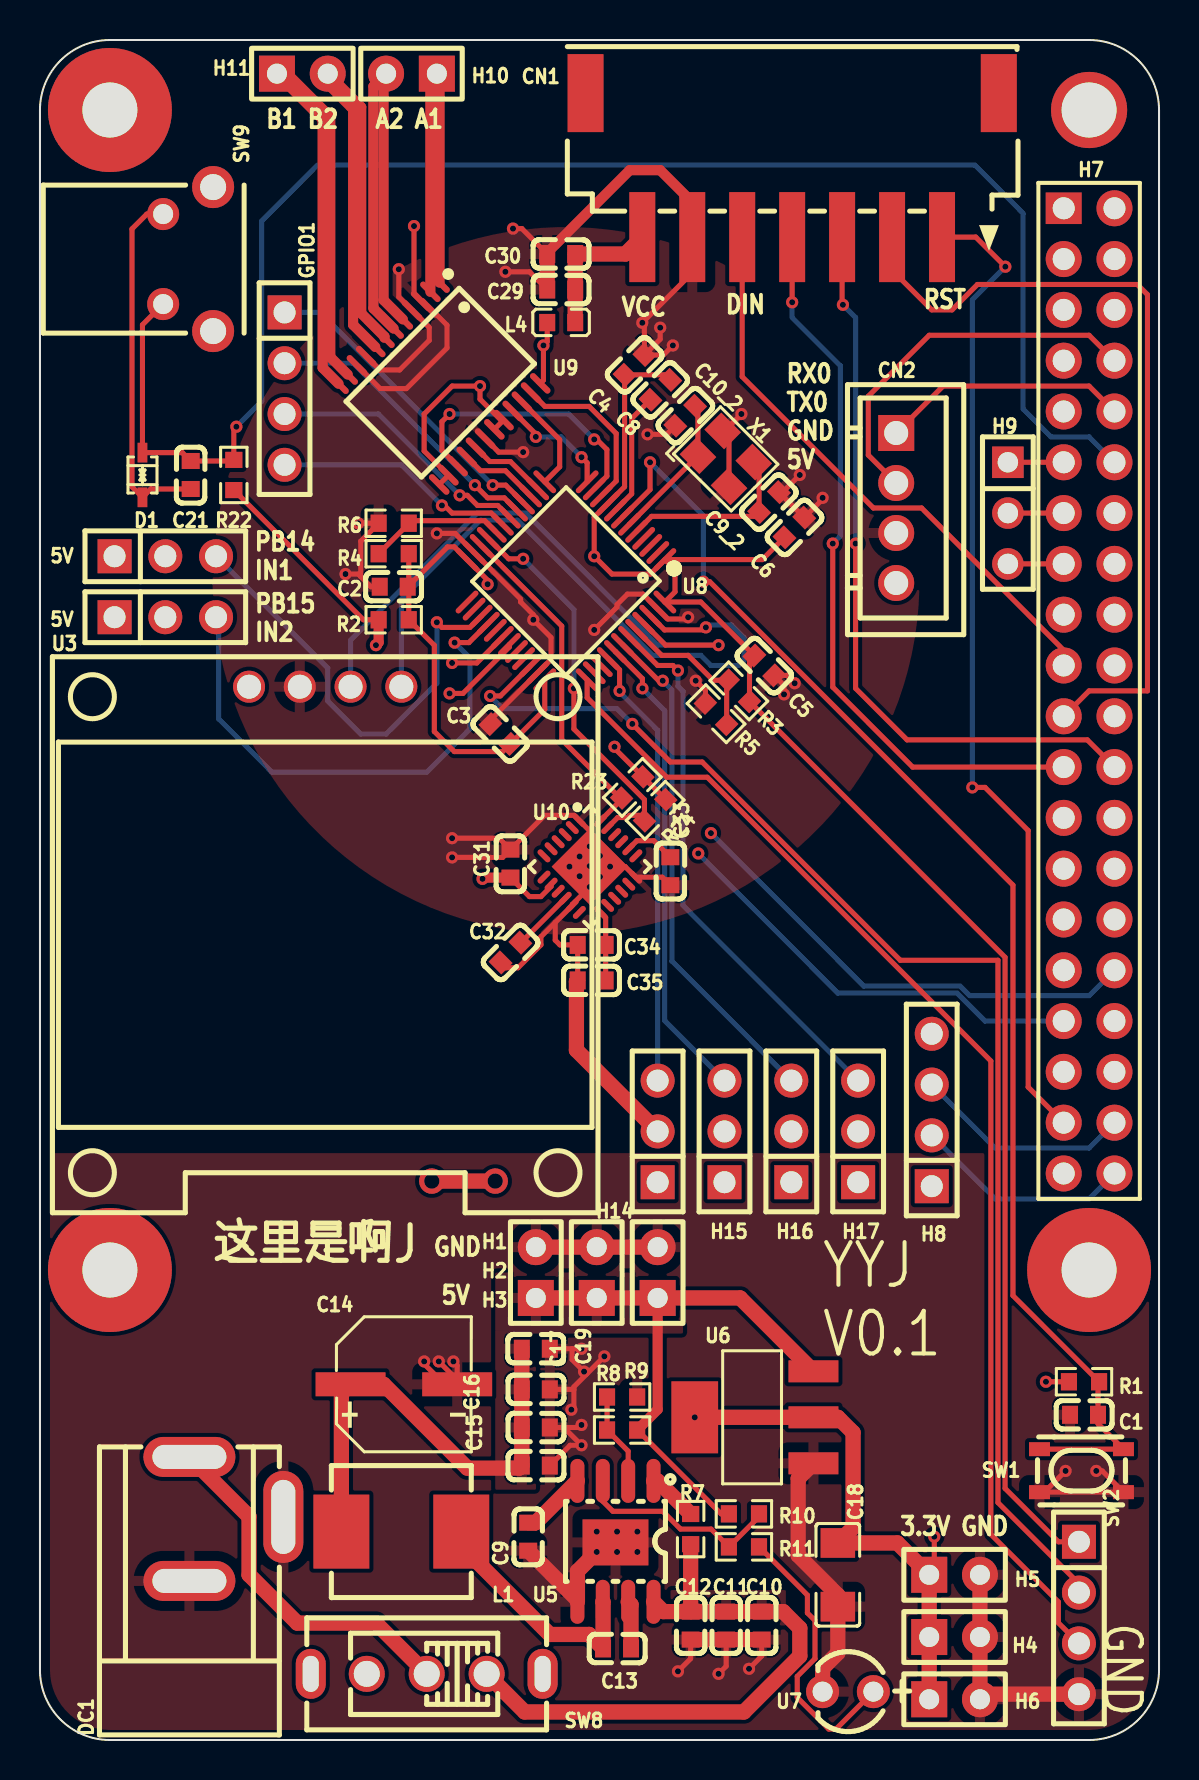
[diagram p4: board, top side]
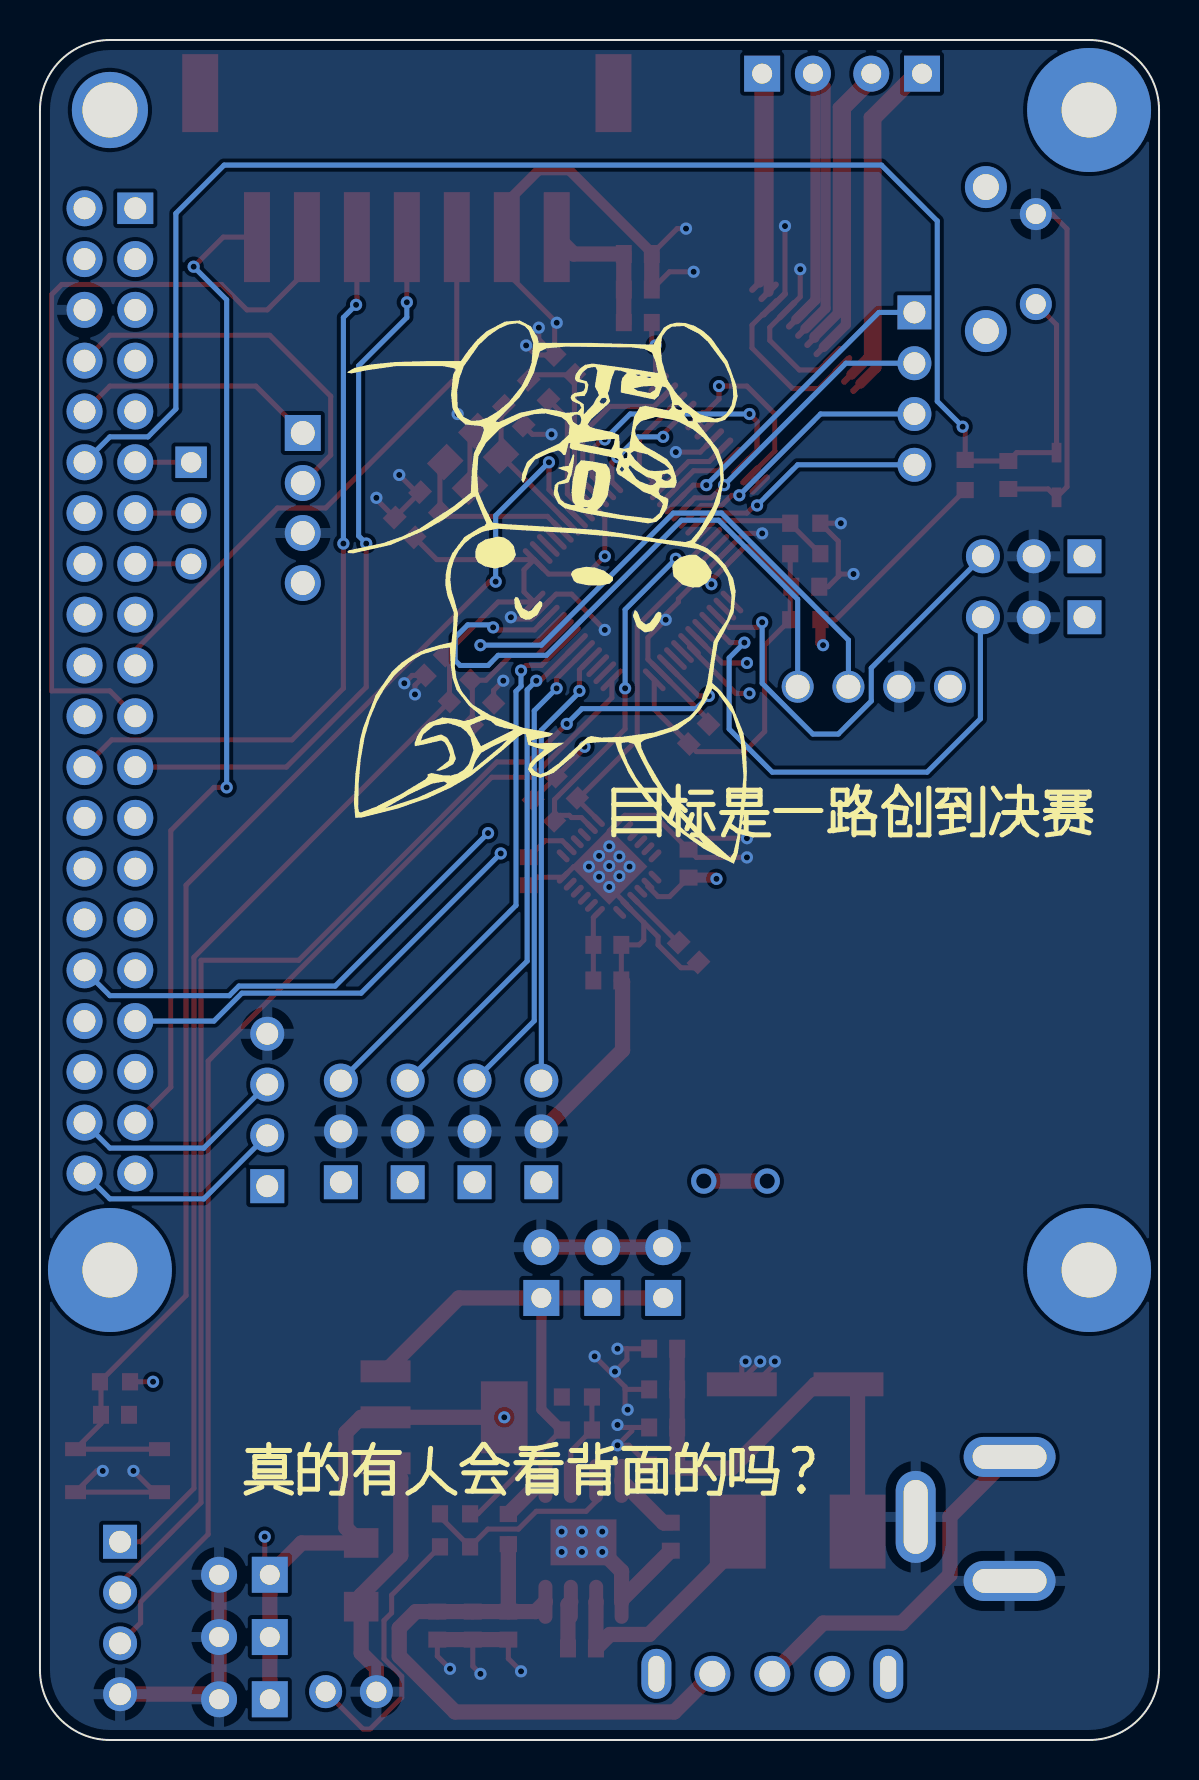
[diagram p5: board, bottom side, seen from below]

Outline 56 x 85 mm; copper layers: Top Layer, Inner1, Inner2, Bottom Layer. Coordinates in mm from the lower left corner of the outline.
Outline path: 0,81.5 0,3.5 arc(1.03,1.03) 3.5,0 52.5,0 arc(54.97,1.03) 56,3.5 56,81.5 arc(54.97,83.97) 52.5,85 3.5,85 arc(1.03,83.97) 0,81.5
Stack: Top Layer 0.035mm / Dielectric1 0.48mm PP er 4.5 / Inner1 0.035mm / Dielectric2 0.48mm FR4 er 4.5 / Inner2 0.035mm / Dielectric3 0.48mm PP er 4.5 / Bottom Layer 0.035mm

## Design rules (mm)
template: JLCPCB Capability(Two Layers Board)
spacing copperThickness1oz (default): track to track 0.102, other pairs 0.152 to 0.3
spacing copperThickness2oz: track to track 0.203, other pairs 0.152 to 0.3
track width copperThickness1oz (default): min 0.127, default 0.254, max 2.54
track width copperThickness2oz: min 0.203, default 0.254, max 2.54
differential pair differentialPair (default): width min 0.127, default 0.254, max 2.54; gap min 0.152, default 0.152
via viaSize (default): diameter min 0.5, default 0.61, max 10; hole min 0.3, default 0.305, max 6.3

## Placement (name value [footprint] x y rotation side)
5V  -  [HDR-TH_3P-P2.54-V-M]  6.27 59.19 0 top
5V#2  -  [HDR-TH_3P-P2.54-V-M]  6.27 56.14 0 top
C1  0.1u  [C0603]  52.25 16.26 180 top
C2  100nF  [C0603]  17.7 57.66 0 top
C3  100nF  [C0603]  23.04 50.3 315 top
C4  100nF  [C0603]  29.75 68.75 225 top
C5  100nF  [C0603]  36.24 53.73 135 top
C6  100nF  [C0603]  37.75 60.63 225 top
C8  100nF  [C0603]  31.05 67.51 45 top
C9  100nF  [C0603]  24.43 10.16 90 top
C9_2  22pF  [C0603]  36.48 61.9 45 top
C10  22uF  [C0603]  36.12 5.72 270 top
C10_2  22pF  [C0603]  32.29 66.21 225 top
C11  22uF  [C0603]  34.34 5.72 270 top
C12  100nF  [C0603]  32.56 5.72 270 top
C13  100nF  [C0603]  28.88 4.58 180 top
C14  100uF  [CAP-SMD_BD6.3-L6.6-W6.6-LS7.6-FD]  18.21 17.78 0 top
C15  22uF  [C0603]  24.81 13.72 180 top
C16  22uF  [C0603]  24.81 15.63 180 top
C17  0.1uF  [C0603]  24.81 17.53 180 top
C18  100nF  [C1206]  39.93 8.26 270 top
C19  100nF  [C0603]  24.81 19.56 0 top
C21  0.1u  [C0603]  7.54 63.25 90 top
C29  100n  [C0603]  26.08 72.52 0 top
C30  10u  [C0603]  26.08 74.3 0 top
C31  100nF  [C0603]  23.54 43.82 90 top
C32  100nF  [C0603]  23.54 39.38 225 top
C33  2.2uF  [C0603]  31.55 43.44 270 top
C34  2.2uF  [C0603]  27.61 39.76 0 top
C35  100nF  [C0603]  27.61 37.98 0 top
CN1  X8821WRS-07-9TSN  [CONN-SMD_X8821WRS-07-9TSN]  37.64 78.74 180 top
CN2  XH-4A  [CONN-TH_4P-P2.50_XH-4A]  42.85 61.6 270 top
D1  SD03C  [SOD-323_L1.8-W1.3-LS2.5-BI]  5.13 63.25 270 top
DC1  -  [DC-IN-TH_DC005]  9.83 11.05 90 top
GPIO1  -  [HDR-TH_4P-P2.54-V-M]  12.24 67.57 270 top
H1  -  [HDR-TH_2P-P2.54-V-M-1]  27.86 23.37 90 top
H2  -  [HDR-TH_2P-P2.54-V-M-1]  24.81 23.37 90 top
H3  -  [HDR-TH_2P-P2.54-V-M-1]  30.91 23.37 90 top
H4  -  [HDR-TH_2P-P2.54-V-M-1]  45.77 5.15 0 top
H5  -  [HDR-TH_2P-P2.54-V-M-1]  45.77 8.26 0 top
H6  -  [HDR-TH_2P-P2.54-V-M-1]  45.77 2.04 0 top
H7  2.54mm 2*20P直排针  [HDR-TH_40P-P2.54-V-M-R2-C20-S2.54]  52.5 52.46 270 top
H8  -  [HDR-TH_4P-P2.54-V-F]  44.63 31.5 90 top
H9  -  [HDR-TH_3P-P2.54-V-F]  48.44 61.35 270 top
H10  -  [HDR-TH_2P-P2.54-V-M-1]  18.59 83.32 180 top
H11  -  [HDR-TH_2P-P2.54-V-M-1]  13.13 83.32 0 top
H14  -  [HDR-TH_3P-P2.54-V-M]  30.91 30.43 90 top
H15  -  [HDR-TH_3P-P2.54-V-M]  34.25 30.43 90 top
H16  -  [HDR-TH_3P-P2.54-V-M]  37.6 30.43 90 top
H17  -  [HDR-TH_3P-P2.54-V-M]  40.94 30.43 90 top
L1  3.3uH  [IND-SMD_L7.0-W6.6]  18.08 10.42 180 top
L4  600Ω  [L0603]  26.08 70.87 0 top
NOREF  -  [Pad_e263]  3.5 81.5 270 top
NOREF#2  -  [Pad_e255]  3.5 23.5 90 top
NOREF#3  -  [Pad_e262]  52.5 81.5 180 top
NOREF#4  -  [Pad_e264]  52.5 23.5 270 top
R1  10k  [R0603]  52.25 17.91 0 top
R2  0  [R0603]  17.7 56.01 180 top
R3  NC  [R0603]  34.97 52.46 315 top
R4  NC  [R0603]  17.7 59.31 0 top
R5  10K  [R0603]  33.83 51.31 315 top
R6  10K  [R0603]  17.7 60.84 0 top
R7  100K  [R0603]  32.56 10.55 90 top
R8  118K  [R0603]  29.13 15.5 0 top
R9  20.5K  [R0603]  29.13 17.15 180 top
R10  118K  [R0603]  35.23 11.31 0 top
R11  440  [R0603]  35.23 9.66 0 top
R22  10k  [R0603]  9.7 63.25 270 top
R23  4.7K  [R0603]  29.64 47.63 45 top
R24  4.7K  [R0603]  30.78 46.49 45 top
SW1  -  [SW-SMD_4P-L4.2-W3.4-P2.15-LS4.5-TL]  52.12 13.47 180 top
SW2  -  [HDR-TH_4P-P2.54-V-M]  51.99 6.1 270 top
SW8  -  [SW-TH_SS-12F44-G5]  19.35 3.31 180 top
SW9  KAN0637-0701B  [SW-TH_KAN0637-0701B]  7.42 74.05 270 top
U3  -  [OLED_0.96-4P]  14.27 40.26 0 top
U5  FR9855SP  [SOIC-8_L4.9-W3.9-P1.27-LS6.0-BL-EP3.3]  28.8 9.93 180 top
U6  -  [SOT-223-3_L6.5-W3.4-P2.30-LS7.0-BR]  35.74 16.13 0 top
U7  -  [LED-TH_BD4.0-P2.54-FD_RED]  40.43 2.42 180 top
U8  -  [LQFP-48_L7.0-W7.0-P0.50-LS9.0-BL]  26.32 57.96 135 top
U9  TB6612FNG,C,8,EL  [SSOP-24_L8.3-W5.6-P0.65-LS7.6-BL]  19.99 67.82 225 top
U10  MPU-6050  [QFN-24_L4.0-W4.0-P0.50-BL-EP2.7]  27.52 43.68 225 top
X1  8MHz  [OSC-SMD_4P-L3.2-W2.5-BL]  34.32 64.06 315 top

## Footprints (pads in the part's own frame, mm; a bottom-side part is the same pattern mirrored in y, then rotated)
C0603
  rect 0.8x0.9 smd: 1(-0.7,0) 2(0.7,0)
C1206
  rect 1.485x1.728 smd: 1(-1.593,0) 2(1.593,0)
CAP-SMD_BD6.3-L6.6-W6.6-LS7.6-FD
  rect 3.5x1.199 smd: 1(-2.67,0) 2(2.67,0)
CONN-SMD_X8821WRS-07-9TSN
  rect 1.3x4.5 smd: 1(-7.5,3.6) 2(-5,3.6) 3(-2.5,3.6) 4(0,3.6) 5(2.5,3.6) 6(5,3.6) 7(7.5,3.6)
  rect 1.8x3.9 smd: 8(10.34,-3.6) 9(-10.34,-3.6)
CONN-TH_4P-P2.50_XH-4A
  rect 1.8x1.8 hole 1.199: 1(-3.751,0)
  round 1.8 hole 1.199: 2(-1.25,0) 3(1.25,0) 4(3.751,0)
DC-IN-TH_DC005
  oval 2x4.6 hole 1.2x3.7: 1(3.1,2.35) 2(-3.1,2.35)
  oval 4.6x2 hole 3.7x1.2: 3(0.1,-2.35)
HDR-TH_2P-P2.54-V-M-1
  rect 1.8x1.8 hole 1: 1(-1.27,0)
  round 1.8 hole 1: 2(1.27,0)
HDR-TH_3P-P2.54-V-F
  rect 1.575x1.575 hole 1.02: 1(-2.54,0)
  round 1.575 hole 1.02: 2(0,0) 3(2.54,0)
HDR-TH_3P-P2.54-V-M
  rect 1.7x1.7 hole 1.1: 1(-2.54,0)
  round 1.7 hole 1.1: 2(0,0) 3(2.54,0)
HDR-TH_4P-P2.54-V-F
  rect 1.7x1.7 hole 1.1: 1(-3.81,0)
  round 1.7 hole 1.1: 2(-1.27,0) 3(1.27,0) 4(3.81,0)
HDR-TH_4P-P2.54-V-M
  rect 1.7x1.7 hole 1.1: 1(-3.81,0)
  round 1.7 hole 1.1: 2(-1.27,0) 3(1.27,0) 4(3.81,0)
HDR-TH_40P-P2.54-V-M-R2-C20-S2.54
  rect 1.575x1.8 hole 1.1: 1(-24.13,-1.27)
  round 1.8 hole 1.1: 2(-24.13,1.27) 3(-21.59,-1.27) 4(-21.59,1.27) 5(-19.05,-1.27) 6(-19.05,1.27) 7(-16.51,-1.27) 8(-16.51,1.27) 9(-13.97,-1.27) 10(-13.97,1.27) 11(-11.43,-1.27) 12(-11.43,1.27) 13(-8.89,-1.27) 14(-8.89,1.27) 15(-6.35,-1.27) 16(-6.35,1.27) 17(-3.81,-1.27) 18(-3.81,1.27) 19(-1.27,-1.27) 20(-1.27,1.27) 21(1.27,-1.27) 22(1.27,1.27) 23(3.81,-1.27) 24(3.81,1.27) 25(6.35,-1.27) 26(6.35,1.27) 27(8.89,-1.27) 28(8.89,1.27) 29(11.43,-1.27) 30(11.43,1.27) 31(13.97,-1.27) 32(13.97,1.27) 33(16.51,-1.27) 34(16.51,1.27) 35(19.05,-1.27) 36(19.05,1.27) 37(21.59,-1.27) 38(21.59,1.27) 39(24.13,-1.27) 40(24.13,1.27)
IND-SMD_L7.0-W6.6
  rect 2.799x3.701 smd: 1(-2.999,0) 2(2.999,0)
L0603
  rect 0.8x0.864 smd: 1(-0.7,0) 2(0.7,0)
LED-TH_BD4.0-P2.54-FD_RED
  round 1.651 hole 1: 1(-1.27,0) 2(1.27,0)
LQFP-48_L7.0-W7.0-P0.50-LS9.0-BL
  oval 0.27x1.5 smd: 1(-2.75,-4.25) 2(-2.25,-4.25) 3(-1.75,-4.25) 4(-1.25,-4.25) 5(-0.75,-4.25) 6(-0.25,-4.25) 7(0.25,-4.25) 8(0.75,-4.25) 9(1.25,-4.25) 10(1.75,-4.25) 11(2.25,-4.25) 12(2.75,-4.25) 25(2.75,4.25) 26(2.25,4.25) 27(1.75,4.25) 28(1.25,4.25) 29(0.75,4.25) 30(0.25,4.25) 31(-0.25,4.25) 32(-0.75,4.25) 33(-1.25,4.25) 34(-1.75,4.25) 35(-2.25,4.25) 36(-2.75,4.25)
  oval 1.5x0.27 smd: 13(4.25,-2.75) 14(4.25,-2.25) 15(4.25,-1.75) 16(4.25,-1.25) 17(4.25,-0.75) 18(4.25,-0.25) 19(4.25,0.25) 20(4.25,0.75) 21(4.25,1.25) 22(4.25,1.75) 23(4.25,2.25) 24(4.25,2.75) 37(-4.25,2.75) 38(-4.25,2.25) 39(-4.25,1.75) 40(-4.25,1.25) 41(-4.25,0.75) 42(-4.25,0.25) 43(-4.25,-0.25) 44(-4.25,-0.75) 45(-4.25,-1.25) 46(-4.25,-1.75) 47(-4.25,-2.25) 48(-4.25,-2.75)
OLED_0.96-4P
  round 1.6 hole 1.2: 1(3.81,12.4) 2(1.27,12.4) 3(-1.27,12.4) 4(-3.81,12.4)
OSC-SMD_4P-L3.2-W2.5-BL
  rect 1.4x1.2 smd: 1(-1.1,-0.875) 2(1.1,-0.875) 3(1.1,0.875) 4(-1.1,0.875)
Pad_e255
  round 6.2 hole 2.75: 1(0,0)
Pad_e262
  round 3.81 hole 2.75: 1(0,0)
Pad_e263
  round 6.2 hole 2.75: 1(0,0)
Pad_e264
  round 6.2 hole 2.75: 1(0,0)
QFN-24_L4.0-W4.0-P0.50-BL-EP2.7
  oval 0.28x0.8 smd: 1(-1.25,-2) 2(-0.75,-2) 3(-0.25,-2) 4(0.25,-2) 5(0.75,-2) 6(1.25,-2) 13(1.25,2) 14(0.75,2) 15(0.25,2) 16(-0.25,2) 17(-0.75,2) 18(-1.242,2)
  oval 0.8x0.28 smd: 7(2,-1.25) 8(2,-0.75) 9(2,-0.25) 10(2,0.25) 11(2,0.75) 12(2,1.25) 19(-2,1.25) 20(-2,0.75) 21(-2,0.25) 22(-2,-0.25) 23(-2,-0.75) 24(-2,-1.25)
  rect 2.7x2.7 smd: 25(0.013,0)
R0603
  rect 0.807x0.864 smd: 1(-0.754,0) 2(0.754,0)
SOD-323_L1.8-W1.3-LS2.5-BI
  rect 0.985x0.49 smd: 1(-1.117,0) 2(1.117,0)
SOIC-8_L4.9-W3.9-P1.27-LS6.0-BL-EP3.3
  oval 0.7x2.2 smd: 1(-1.905,-3.022) 2(-0.635,-3.022) 3(0.635,-3.022) 4(1.905,-3.022) 5(1.905,3.022) 6(0.635,3.022) 7(-0.635,3.022) 8(-1.905,3.022)
  rect 3.3x2.3 smd: 9(0,0.051)
SOT-223-3_L6.5-W3.4-P2.30-LS7.0-BR
  rect 2.5x1.1 smd: 1(2.97,-2.3) 2(2.97,0) 3(2.97,2.3)
  rect 2.34x3.6 smd: 4(-2.97,0)
SSOP-24_L8.3-W5.6-P0.65-LS7.6-BL
  oval 0.308x1.324 smd: 1(-3.575,-3.562) 2(-2.925,-3.562) 3(-2.275,-3.562) 4(-1.625,-3.562) 5(-0.975,-3.562) 6(-0.325,-3.562) 7(0.325,-3.562) 8(0.975,-3.562) 9(1.625,-3.562) 10(2.275,-3.562) 11(2.925,-3.562) 12(3.575,-3.562) 13(3.575,3.562) 14(2.925,3.562) 15(2.275,3.562) 16(1.625,3.562) 17(0.975,3.562) 18(0.325,3.562) 19(-0.325,3.562) 20(-0.975,3.562) 21(-1.625,3.562) 22(-2.275,3.562) 23(-2.925,3.562) 24(-3.575,3.562)
SW-SMD_4P-L4.2-W3.4-P2.15-LS4.5-TL
  rect 1.049x0.701 smd: 1(-2.1,1.075) 2(2.1,1.075) 3(-2.1,-1.075) 4(2.1,-1.075)
SW-TH_KAN0637-0701B
  round 1.6 hole 1: 1(-2.25,-1.25) 2(2.25,-1.25)
  round 2.1 hole 1.3: 3(-3.6,1.25) 4(3.6,1.25)
SW-TH_SS-12F44-G5
  round 1.801 hole 1.3: 1(-2.999,0) 2(0,0) 3(2.999,0)
  oval 1.501x2.499 hole 0.8x1.801: 4(5.801,0) 5(-5.799,0)

## Nets
As in the schematic, except:
GND: 5V.2 5V#2.2 C1.2 C2.1 C3.1 C4.1 C5.1 C6.1 C9.1 C9_2.2 C10.2 C10_2.2 C11.2 C12.2 C14.2 C15.1 C16.1 C17.1 C18.2 C19.2 C21.1 C29.1 C30.1 C31.2 C32.2 C33.2 C34.1 C35.1 CN1.6 CN2.3 D1.2 DC1.2 DC1.3 H1.2 H2.2 H3.2 H4.2 H5.2 H6.2 H7.6 H8.4 H14.2 H15.2 H16.2 H17.2 R5.1 R6.1 R9.1 SW1.1 SW1.2 SW2.4 SW9.1 U3.3 U5.5 U5.9 U6.1 U7.2 U8.23 U8.35 U8.47 U9.3 U9.4 U9.9 U9.10 U9.18 U10.1 U10.11 U10.18 U10.25 X1.2 X1.4
VCC_3.3V: C18.1 C31.1 H4.1 H5.1 H6.1 R1.1 R2.2 R22.2 R23.2 R24.2 U6.2 U6.4 U10.8
VCC_3V: C34.2 C35.2 U10.13
VCC_5V: 5V.1 5V#2.1 C14.1 C15.2 C16.2 C17.2 C19.1 CN2.4 H1.1 H2.1 H3.1 H7.2 H8.1 H14.1 H15.1 H16.1 H17.1 L1.2 L4.1 R8.2 R10.1 U3.4 U6.3 U9.13 U9.14 U9.19 U9.20 U9.24
PB14_IN1: 5V.3 U8.27
PB15_IN2: 5V#2.3 U8.28

Pads without a net: CN1 8 9; H7 1 3 4 5 7 9 14 16 17 18 20 22 25 26 27 28 29 30 31 34 35 36 39; NOREF 1; NOREF#2 1; NOREF#3 1; NOREF#4 1; SW8 3 4 5; SW9 3 4; U8 2 3 4 25 26 29 32 33 38 39; U10 2 3 4 5 6 7 9 12 14 15 16 17 19 21 22

## Via types
v1: diameter 0.61, hole 0.305, Top Layer to Bottom Layer, 95 vias
v2: diameter 1.27, hole 0.762, Top Layer to Bottom Layer, 2 vias

## Routing (per net, layer and track width the routed paths; a pad name or vN(x,y) marks a point on that pad's centre or on a via; arc(x,y) is an arc through that point)
AGND: length 6.2
  Top Layer w0.254: U8.8 29.61,62.31 29.61,66.08 C8.1
GND: length 247
  Top Layer w0.254: v1(23.29,73.41) 24.49,73.41 C29.1 ; v1(31.04,70.62) 31.04,70.04 C4.1 ; v1(15.92,60.84) R6.1 16.05,59.94 16.05,58.17 ; C21.1 5.55,62.55 D1.2 4.61,62.66 4.61,75.55 5.35,76.3 SW9.1 ; v1(38.02,63.25) 37.16,62.39 C9_2.2 C6.1 39.17,62.04 v1(39.17,62.11) ; 19.85,71.26 19.16,71.95 19.08,71.95 ; 19.85,71.26 20.37,70.74 20.37,69.6 18.34,67.57 17.02,67.57 U9.10 ; 19.85,71.26 19.77,71.26 19.08,71.95 ; C30.1 24.11,75.57 v1(23.67,75.57) ; C15.1 26.53,14.74 v1(27.1,14.74) 26.38,15.45 26.38,15.63 ; C12.2 32.56,4.07 v1(31.93,3.43) ; v1(31.67,69.73) 31.19,69.25 C4.1 ; C17.1 26.72,17.53 ; 26.72,17.53 26.72,17.66 v1(28.24,19.18) ; 26.72,17.53 26.72,16.64 v1(26.59,16.51) ; 25.79,40.88 25.79,39.99 26.02,39.76 C34.1 C35.1 ; 25.79,40.88 25.07,40.16 25.07,39.76 23.92,38.61 23.32,38.61 C32.2 ; 25.79,40.88 26.64,41.73 26.64,41.78 v1(27.51,42.65) ; 20.88,18.01 v1(19.96,18.93) ; 20.88,18.01 20.88,18.74 v1(20.69,18.93) ; 20.88,18.01 C14.2 20.24,17.78 19.23,18.8 v1(19.23,18.93) ; v1(27.1,15.75) 26.97,15.63 26.38,15.63 ; SW1.2 50.26,12.39 ; 50.26,12.39 v1(51.32,13.45) ; 50.26,12.39 SW1.1 53.16,13.45 v1(52.86,13.45) ; 34.48,62.66 34.48,65.13 X1.4 34.25,65.45 v1(35.1,66.3) ; v1(17.96,73.54) 17.96,72.15 U9.4 19.48,70.63 19.48,69.98 18,68.5 17.01,68.5 16.32,69.19 ; 26.63,19.56 26.63,19.02 v1(27.23,18.42) ; 26.63,19.56 C19.2 ; 26.63,19.56 v1(27.1,19.56) ; 19.08,71.95 18.72,72.31 v1(18.72,75.7) ; C4.1 30.25,70.76 v1(30.14,70.86) 32.64,73.36 CN1.6 ; 16.05,58.17 16.56,57.66 C2.1 ; 16.05,58.17 15.92,58.3 v1(15.29,58.3) ; 26.38,15.63 C16.1 ; C31.2 22.97,45.09 v1(20.62,45.09) ; C31.2 23.15,44.13 v1(20.62,44.13) ; C31.2 25.26,46.23 26.73,46.23 U10.1 27.51,45.45 v1(27.51,44.68) ; v1(35.48,3.56) 36.12,4.2 C10.2 ; C10_2.2 31.36,65.28 v1(30.4,65.28) ; U9.18 22.96,64.39 v1(24.18,64.39) ; v1(32.43,56.14) 32.47,56.14 32.56,56.05 31.41,56.05 U8.47 30.17,57.29 29.4,57.29 28.88,56.77 28.88,56.65 v1(27.73,55.5) ; v1(19.86,60.33) 20.77,60.33 U8.23 24.05,57.05 24.05,56.9 24.69,56.27 v1(24.69,56.01) 25.58,55.12 25.58,54.03 U8.35 22.54,51 C3.1 ; C33.2 31.14,43.14 29.81,43.14 29.29,43.67 v1(28.53,43.67) ; C11.2 34.34,3.69 v1(33.96,3.31) ; v1(32.82,52.96) 33.3,52.48 R5.1 ; v1(37.23,52.28) 37.23,52.74 36.74,53.23 37.37,53.23 v1(37.77,52.84)
  Top Layer w0.508: 25.38,74.36 29.51,78.49 31.04,78.49 32.64,76.89 CN1.6
  Top Layer w0.762: H2.2 H1.2 H3.2 ; v1(27.86,9.4) 26.89,8.44 26.89,7 ; C29.1 C30.1 ; SW2.4 47.29,2.29 H6.2 H4.2 H5.2 ; C12.2 C11.2 C10.2 ; H14.2 26.85,34.49 26.85,37.92 C35.1 ; U7.2 39.17,3.59 39.93,4.35 C18.2 39.93,7.24 37.94,9.23 37.94,13.07 U6.1 ; U5.5 26.89,7 ; 26.89,7 C9.1
  Inner1 w0.254: v1(27.73,55.5) 27.23,56.01 v1(24.69,56.01)
  Inner2 w0.762: U3.3 11.43,54.23 7.67,54.23 6.27,55.63 5V#2.2 5V.2 ; H14.2 H15.2 H16.2 H17.2 42.85,32.33 42.85,33.66 44.5,35.31 H8.4
  vias: v1(26.5,43.67) v1(27.01,44.18) v1(27.01,43.19) v1(27.51,43.7) v1(27.86,10.42) v1(28.02,44.21) v1(28.02,43.16) v1(28.88,10.42) v1(28.88,9.4) v1(29.89,10.42) v1(29.89,9.4)
VCC_3.3V: length 133.4
  Top Layer w0.254: C31.1 24.49,42.17 25.07,42.17 25.58,42.68 25.58,42.79 ; R2.2 16.19,56.01 R22.2 ; R1.1 v1(50.34,17.91) ; v1(28.75,49.66) 28.75,49.58 R23.2 R24.2 ; H5.1 44.75,8.51 v1(44.75,10.16)
  Top Layer w0.508: R2.2 16.95,54.88 v1(16.81,54.74) ; C31.1 22.21,43.12 v1(22.15,43.06)
  Top Layer w0.762: H6.1 H4.1 H5.1 42.91,9.85 C18.1 40.69,10.61 40.69,15.37 39.93,16.13 U6.2 v1(32.77,16.13)
  Inner1 w0.254: v1(22.15,43.06) 24.56,40.64 31.8,40.64 36.12,44.96 36.12,46.49 32.94,49.66 v1(28.75,49.66)
  Inner2 w0.254: v1(50.34,17.91) 50.34,15.75 v1(44.75,10.16)
  Inner2 w0.508: v1(32.77,16.13) 28.12,16.13 21.39,22.86 21.39,40.77 22.15,41.53 v1(22.15,43.06) 22.15,46.87 16.81,52.2 v1(16.81,54.74)
VCC_3V: length 3.5
  Top Layer w0.254: C35.2 C34.2 28.31,41.12 U10.13
VCC_5V: length 255.2
  Top Layer w0.254: R10.1 34.08,11.31 30.15,15.25 30.15,15.38 ; U9.19 U9.20 23.07,65.99 22.02,67.04 v1(22.02,67.7) 20.62,67.7 19.23,66.3 19.23,64.45 U9.14 U9.13 ; L4.1 25.38,69.92 v1(25.2,69.73) 25.2,67.99 U9.24
  Top Layer w0.508: H3.1 30.91,16.52 R8.2
  Top Layer w0.762: H2.1 H1.1 H3.1 35.04,22.1 U6.3 ; v2(22.78,27.94) v2(19.61,27.94) ; L1.2 15.08,17.33 C14.1 17.19,17.78 21.39,13.59 23.99,13.59 C15.2 C16.2 C17.2 C19.1
  Inner2 w0.254: 30.91,27.89 30.91,29.3 ; 30.85,27.94 25.2,33.6 25.2,53.98 29.13,57.92 29.13,66.04 25.45,69.73 v1(25.2,69.73) 23.16,67.7 v1(22.02,67.7)
  Inner2 w0.762: H3.1 34.25,25.45 34.25,27.89 ; v2(22.78,27.94) 30.85,27.94 30.91,27.89 34.25,27.89 ; 5V.1 5V#2.1 3.73,54.23 5.3,52.66 U3.4 17.19,45.93 17.19,28.33 19.23,28.33 v2(19.61,27.94) ; 34.25,27.89 44.43,27.89 H8.1 46.79,29.85 46.79,35.11 42.85,39.04 CN2.4 46.02,61.02 46.02,76.46 47.93,78.36 51.99,78.36 H7.2
VCC_12V: length 30.2
  Top Layer w0.762: U5.8 31.2,6.42 C12.1 ; C12.1 C11.1 C10.1 37.19,6.42 38.02,5.59 38.02,4.2 35.23,1.4 24.26,1.4 SW8.1 ; C12.1 R7.1
VCC_IN: length 18.1
  Top Layer w0.762: DC1.1 10.46,11.17 10.46,8.26 12.88,5.85 16.81,5.85 SW8.2
VDD: length 112
  Top Layer w0.254: U8.1 36.14,59.02 C6.2 ; U8.1 30.55,58.3 28.62,58.3 v1(27.73,59.19) 27.73,61.14 U8.9 29.26,62.66 C4.2 31.29,68.26 C8.2 ; U8.1 31.78,58.51 31.78,57.41 U8.48 33.07,56.9 35.75,54.22 35.51,53.98 R3.2 48.3,39.13 48.3,12.58 50.96,9.91 SW2.1 ; 18.46,57.72 20.39,59.66 20.74,59.66 U8.24 22.4,57.99 v1(22.4,57.79) ; 18.46,57.72 C2.2 18.46,57.61 R2.1 19.73,54.73 19.73,50.42 20.74,49.42 23.15,49.42 C3.2 25.26,51.53 U8.36 ; 18.46,57.72 R4.2
  Inner1 w0.254: v1(22.4,57.79) 22.83,58.22 25.63,58.22 26.08,58.68 27.23,58.68 v1(27.73,59.19)
A1: length 21.5
  Top Layer w0.508: U9.2 19.54,82.99 H10.1 20,83.18 U9.1
A2: length 26
  Top Layer w0.508: U9.5 17.19,72 17.19,83.19 ; U9.6 16.69,71.58 16.69,82.68 17.19,83.19 ; 17.19,83.19 H10.2
B1: length 33.6
  Top Layer w0.508: U9.12 14.15,68.61 14.15,81.03 H11.1 12.37,83.32 14.53,81.16 14.53,69.15 U9.11
B2: length 29
  Top Layer w0.508: U9.7 17.24,70.17 16.08,71.33 16.08,81.64 14.4,83.32 14.4,82.81 15.67,81.54 15.67,70.76 U9.8
BOOT0: length 7.9
  Top Layer w0.254: R5.2 34.36,52.91 R3.1 33.68,52.99 32.44,54.23 31.11,54.23 U8.44
BOOT1: length 6.8
  Top Layer w0.254: R4.1 18.46,60.82 R6.2 18.58,60.96 22.26,60.96 22.79,60.43
D0_LCD_DC: length 40.5
  Top Layer w0.254: CN1.2 42.64,73.49 44.63,71.51 45.64,71.51 46.91,72.78 54.91,72.78 55.42,72.27 55.42,52.46 52.5,52.46 51.23,51.19
D1_LCD_RST: length 49.5
  Top Layer w0.254: v1(48.31,73.66) 46.83,75.14 CN1.1 ; 51.23,30.87 49.45,32.64 49.45,45.47 47.29,47.63 v1(46.66,47.63)
  Bottom Layer w0.254: v1(46.66,47.63) 46.66,72.01 v1(48.31,73.66)
D5_LCD_SCK: length 36.9
  Top Layer w0.254: v1(37.64,71.89) CN1.4 ; 51.23,48.65 43.67,48.65 39.67,52.64 v1(39.67,59.82)
  Bottom Layer w0.254: v1(39.67,59.82) 40.05,60.2 40.05,68.71 37.64,71.12 v1(37.64,71.89)
D7_LCD_DIN: length 29.5
  Top Layer w0.254: 51.23,53.73 51.23,54.49 44.12,61.6 41.7,61.6 35.14,68.16 CN1.5
D8_LCD_CS: length 37.4
  Top Layer w0.254: v1(40.82,59.82) 40.82,52.58 43.39,50.01 52.41,50.01 H7.24 ; CN1.3 40.14,71.8 v1(40.18,71.76)
  Bottom Layer w0.254: v1(40.18,71.76) 40.82,71.12 v1(40.82,59.82)
FR_BST: length 2.4
  Top Layer w0.762: U5.7 29.58,6.77 C13.1
FR_FB: length 4.6
  Top Layer w0.254: R9.2 R8.1 29.43,14.44 U5.2
FR_PG: length 10.5
  Top Layer w0.254: R10.2 35.98,11.16 R11.1 33.59,10.55 32.05,10.55 31.16,11.44 28.67,11.44 28.17,11.94 U5.3
GPIO0: length 2.8
  Top Layer w0.254: H9.1 51.23,63.89
GPIO1_KEY: length 80.9
  Top Layer w0.254: v1(9.83,65.66) 9.7,65.54 R22.1 9.65,63.95 C21.2 7.12,64.37 D1.1 5.13,70.76 SW9.2
  Bottom Layer w0.254: v1(9.83,65.66) 11.1,66.93 11.1,75.95 13.89,78.74 46.79,78.74 49.2,76.33 49.2,66.55 50.6,65.16 52.5,65.16 H7.12
GPIO2: length 2.8
  Top Layer w0.254: H9.2 51.23,61.35
GPIO3: length 2.8
  Top Layer w0.254: H9.3 51.23,58.81
GPIO28_EC: length 11
  Bottom Layer w0.254: H8.3 47.8,29.6 52.5,29.6 H7.38
GPIO29_TR: length 11
  Bottom Layer w0.254: H7.40 52.5,27.06 47.8,27.06 H8.2
OS_8M_IN: length 9.1
  Top Layer w0.254: U8.5 30.6,61.18 35.77,61.18 C9_2.1 35.99,63.63 35.72,63.9
OS_8M_OUT: length 7.4
  Top Layer w0.254: C10_2.1 32.93,66.57 32.93,64.21 29.5,60.79 U8.6
PA0_PWMA: length 8.5
  Top Layer w0.254: U9.23 25.27,66.68 27.48,66.68 28.84,65.32 28.84,62.95 U8.10
PA1_PWMB: length 13.9
  Top Layer w0.254: v1(27.73,65.03) 27.86,65.03 28.37,64.52 28.37,63.19 U8.11 ; U9.15 20.11,64.48 20.11,65.92 v1(20.5,66.3)
  Bottom Layer w0.254: v1(20.5,66.3) 26.46,66.3 v1(27.73,65.03)
PA2_AIN1: length 5.8
  Top Layer w0.254: U9.21 24.81,65.29 v1(24.81,65.16) ; U8.12 27.38,63.86 v1(27.1,64.14)
  Bottom Layer w0.254: v1(24.81,65.16) 26.08,65.16 v1(27.1,64.14)
PA3_AIN2: length 5.1
  Top Layer w0.254: U8.13 26.01,63.66 26.01,65.02 24.12,66.91
PA4_BIN1: length 3.9
  Top Layer w0.254: U8.14 23.54,63.92 22.51,63.92 U9.17
PA5_BIN2: length 4
  Top Layer w0.254: 21.36,64.15 22.05,63.46 23.29,63.46 24.55,62.2
PA6: length 15.9
  Top Layer w0.254: U8.16 23.31,62.74 v1(22.65,62.74)
  Bottom Layer w0.254: GPIO1.1 14.02,71.38 v1(22.65,62.74)
PA7: length 14.6
  Top Layer w0.254: U8.17 23.23,62.11 22.4,62.11 v1(21.77,62.74)
  Bottom Layer w0.254: GPIO1.2 15.67,68.84 v1(21.77,62.74)
PA9_TX1: length 43.6
  Top Layer w0.254: v1(20.62,53.85) 21.86,53.85 U8.30
  Inner1 w0.254: v1(32.94,44.33) 32.43,44.84 29.89,44.84 24.81,49.92 21.51,49.92 19.73,51.69 19.73,52.96 v1(20.62,53.85)
  Bottom Layer w0.254: 51.23,35.95 47.29,35.95 45.9,37.34 39.93,37.34 v1(32.94,44.33)
PA10_RX1: length 45.4
  Top Layer w0.254: U8.31 23.49,54.66 21.17,52.33 v1(20.5,52.33)
  Inner1 w0.254: v1(33.58,45.34) 30.91,45.34 22.77,53.48 21.14,53.48 20.5,52.84 v1(20.5,52.33)
  Bottom Layer w0.254: v1(33.58,45.34) 41.22,37.7 46.04,37.7 46.53,37.22 52.5,37.22 H7.32
PB0: length 13.4
  Top Layer w0.254: U8.18 22.91,61.73 21.89,61.73 21.39,62.23 v1(21,62.23)
  Bottom Layer w0.254: GPIO1.3 16.94,66.3 v1(21,62.23)
PB1: length 12.1
  Top Layer w0.254: U8.19 22.58,61.35 20.62,61.35 20.24,61.73 v1(20.11,61.73)
  Bottom Layer w0.254: v1(20.11,61.73) 18.08,63.76 GPIO1.4
PB4_INFRARED1: length 22.1
  Top Layer w0.254: U8.40 29.01,53.51 v1(29.01,52.46)
  Bottom Layer w0.254: H14.3 30.91,50.49 29.01,52.39 v1(29.01,52.46)
PB5_INFRARED2: length 23.7
  Top Layer w0.254: U8.41 28.8,54.42 30.15,53.07 v1(30.15,52.58)
  Bottom Layer w0.254: H15.3 31.27,35.96 31.27,51.47 v1(30.15,52.58)
PB6_INFRARED3: length 25.4
  Top Layer w0.254: 29.15,54.78 30.96,52.96 v1(31.16,52.96)
  Bottom Layer w0.254: v1(31.16,52.96) 31.62,52.51 31.62,38.95 H16.3
PB7_INFRARED4: length 27.3
  Top Layer w0.254: v1(31.93,53.47) 31.67,53.73 30.91,53.73 U8.43
  Bottom Layer w0.254: H17.3 32.18,41.73 32.18,52.44 31.93,52.69 v1(31.93,53.47)
PB8_SCL_OLED: length 30.3
  Top Layer w0.254: v1(33.96,54.74) 31.31,54.74 U8.45
  Bottom Layer w0.254: U3.2 15.54,55 21.89,61.35 24.31,61.35 30.91,54.74 v1(33.96,54.74)
PB9_SDA_OLED: length 32.7
  Top Layer w0.254: v1(33.32,55.63) 33.2,55.5 31.25,55.5 U8.46
  Bottom Layer w0.254: U3.1 18.08,57.03 22.04,60.99 23.9,60.99 30.66,54.23 33.07,54.23 33.58,53.73 34.97,53.73 35.23,53.98 35.23,55.12 34.59,55.76 33.45,55.76 v1(33.32,55.63)
PB10_SCL: length 20
  Top Layer w0.254: v1(26.72,52.58) 26.72,50.55 30.25,47.02 R24.1 29.97,46.23 29.51,46.23 29.4,46.12 28.91,46.12 U10.23 ; v1(24.18,59.06) 23.45,59.06 U8.21
  Bottom Layer w0.254: v1(26.72,52.58) 26.72,56.52 v1(24.18,59.06)
PB11_SDA: length 17
  Top Layer w0.254: 28.98,46.97 28.98,46.9 U10.24 ; R23.1 29.03,47.1 26.11,50.02 26.11,55.7 U8.22
PB14_IN1: length 22.4
  Top Layer w0.254: v1(19.86,55.88) 20.11,55.63 21.52,55.63 U8.27
  Bottom Layer w0.254: 5V.3 14.4,53.6 14.4,51.95 16.05,50.3 17.32,50.3 19.86,52.84 v1(19.86,55.88)
PB15_IN2: length 26.4
  Top Layer w0.254: U8.28 21.46,54.87 v1(20.75,54.87)
  Bottom Layer w0.254: 8.94,56.14 8.94,51.06 11.61,48.39 19.35,48.39 21.51,50.55 21.51,54.11 v1(20.75,54.87)
RESET: length 66.9
  Top Layer w0.254: 29.15,61.14 30.53,62.52 v1(30.53,63.89) ; SW1.4 SW1.3 52.95,15.81 52.95,17.86 R1.2 48.69,22.22 48.69,42.74 33.51,57.92 v1(33.2,57.92)
  Bottom Layer w0.254: v1(30.53,63.89) 33.2,61.22 v1(33.2,57.92)
RX0: length 12.4
  Top Layer w0.254: CN2.1 45.19,67.7 52.5,67.7 H7.10
SWCLK: length 59.6
  Top Layer w0.254: U8.37 27.38,52.12 31.36,48.14 33.4,48.14 47.58,33.95 47.58,10.28 50.96,6.9 50.96,5.86 SW2.3
SWDIO: length 66.8
  Top Layer w0.254: 24.55,53.72 23.04,52.2 v1(22.53,52.2) ; 51.99,7.37 51.99,7.82 47.94,11.87 47.94,38.99 43.05,38.99 33.14,48.9 31.55,48.9 v1(29.64,50.8)
  Bottom Layer w0.254: v1(29.64,50.8) 28.88,51.57 23.16,51.57 v1(22.53,52.2)
TX0: length 19
  Top Layer w0.254: CN2.2 41.45,64.25 41.45,67.19 44.5,70.24 52.5,70.24 H7.8
$4N1181: length 2.5
  Top Layer w0.762: R7.2 30.9,12.96 U5.1
$4N1291: length 3.3
  Top Layer w0.762: U5.4 24.8,10.86 C9.2
$4N2089: length 12.3
  Top Layer w0.762: L1.1 21.08,9.71 25.51,5.28 27.48,5.28 C13.2 28.18,6.9 U5.6
$4N5315: length 14.3
  Top Layer w0.254: U7.1 39.83,0.55 39.47,0.55 37.89,2.13 37.89,3.18 38.78,4.07 38.78,5.97 38.4,6.35 38.4,7.24 35.99,9.66 R11.2
$6N577: length 7.1
  Top Layer w0.762: L4.2 C29.2 C30.2 29.3,74.3 CN1.7
$7N1404: length 3.2
  Top Layer w0.254: 26.28,42.09 24.07,39.87 C32.1
$7N1517: length 2.6
  Top Layer w0.254: U10.20 29.87,44.96 30.72,44.96 C33.1

## Copper pours and planes (outline as drawn; the poured copper is in the pictures)
GND on Top Layer: 44.01,58.37 43.97,59.18 43.89,60 43.78,60.81 43.63,61.61 43.44,62.41 43.22,63.19 42.96,63.97 42.67,64.73 42.33,65.48 41.97,66.21 41.57,66.92 41.14,67.62 40.68,68.29 40.19,68.94 39.67,69.57 39.12,70.18 38.54,70.75 37.93,71.3 37.31,71.83 36.65,72.32 35.98,72.78 35.28,73.21 34.57,73.61 33.84,73.97 33.09,74.3 32.33,74.6 31.56,74.86 30.77,75.08 29.97,75.27 29.17,75.42 28.36,75.53 27.55,75.61 26.73,75.64 25.91,75.64 25.1,75.61 24.28,75.53 23.48,75.42 22.67,75.27 21.88,75.08 21.09,74.86 20.32,74.6 19.55,74.3 18.81,73.97 18.07,73.61 17.36,73.21 16.67,72.78 15.99,72.32 15.34,71.83 14.71,71.3 14.11,70.75 13.53,70.18 12.98,69.57 12.46,68.94 11.96,68.29 11.5,67.62 11.07,66.92 10.68,66.21 10.31,65.48 9.98,64.73 9.69,63.97 9.43,63.19 9.2,62.41 9.02,61.61 8.87,60.81 8.75,60 8.68,59.18 8.64,58.37 8.64,57.55 8.68,56.74 8.75,55.92 8.87,55.11 9.02,54.31 9.2,53.51 9.43,52.73 9.69,51.95 9.98,51.19 10.31,50.44 10.68,49.71 11.07,49 11.5,48.3 11.96,47.63 12.46,46.98 12.98,46.35 13.53,45.74 14.11,45.17 14.71,44.62 15.34,44.09 15.99,43.6 16.67,43.14 17.36,42.71 18.07,42.31 18.81,41.95 19.55,41.62 20.32,41.32 21.09,41.06 21.88,40.84 22.67,40.65 23.48,40.5 24.28,40.39 25.1,40.31 25.91,40.28 26.73,40.28 27.55,40.31 28.36,40.39 29.17,40.5 29.97,40.65 30.77,40.84 31.56,41.06 32.33,41.32 33.09,41.62 33.84,41.95 34.57,42.31 35.28,42.71 35.98,43.14 36.65,43.6 37.31,44.09 37.93,44.62 38.54,45.17 39.12,45.74 39.67,46.35 40.19,46.98 40.68,47.63 41.14,48.3 41.57,49 41.97,49.71 42.33,50.44 42.67,51.19 42.96,51.95 43.22,52.73 43.44,53.51 43.63,54.31 43.78,55.11 43.89,55.92 43.97,56.74 44.01,57.55
GND on Top Layer: -5.41,29.34 60.12,29.34 60.12,-3.04 -5.41,-3.04
GND on Bottom Layer: -8.71,97.03 65.07,97.03 65.07,-13.97 -8.71,-13.97
GND on Inner1: -5.41,-10.79 60.88,-10.79 60.88,90.81 -5.41,90.81
VCC_5V on Top Layer: 22.78,20.45 24.82,20.45 24.82,12.51 22.78,12.51
VCC_5V on Top Layer: 22.78,23.37 32.18,23.37 32.18,20.32 22.78,20.32
VCC_12V on Top Layer: 30.15,7.5 37.33,7.5 37.33,5.73 30.15,5.73

## Text on the board
Bottom Silkscreen Layer: 目标是一路创到决赛 | 真的有人会看背面的吗？
Top Silkscreen Layer: PB14 / IN1 | PB15 / IN2 | B1 B2 | A2 A1 | GND | 5V | VCC | DIN | RX0 / TX0 / GND / 5V | 3.3V GND | RST | YYJ / V0.1 | 这里是啊J
